# EAGLE design QSPIC Master (EAGLE 5.06)

## Sheet 1 of 2
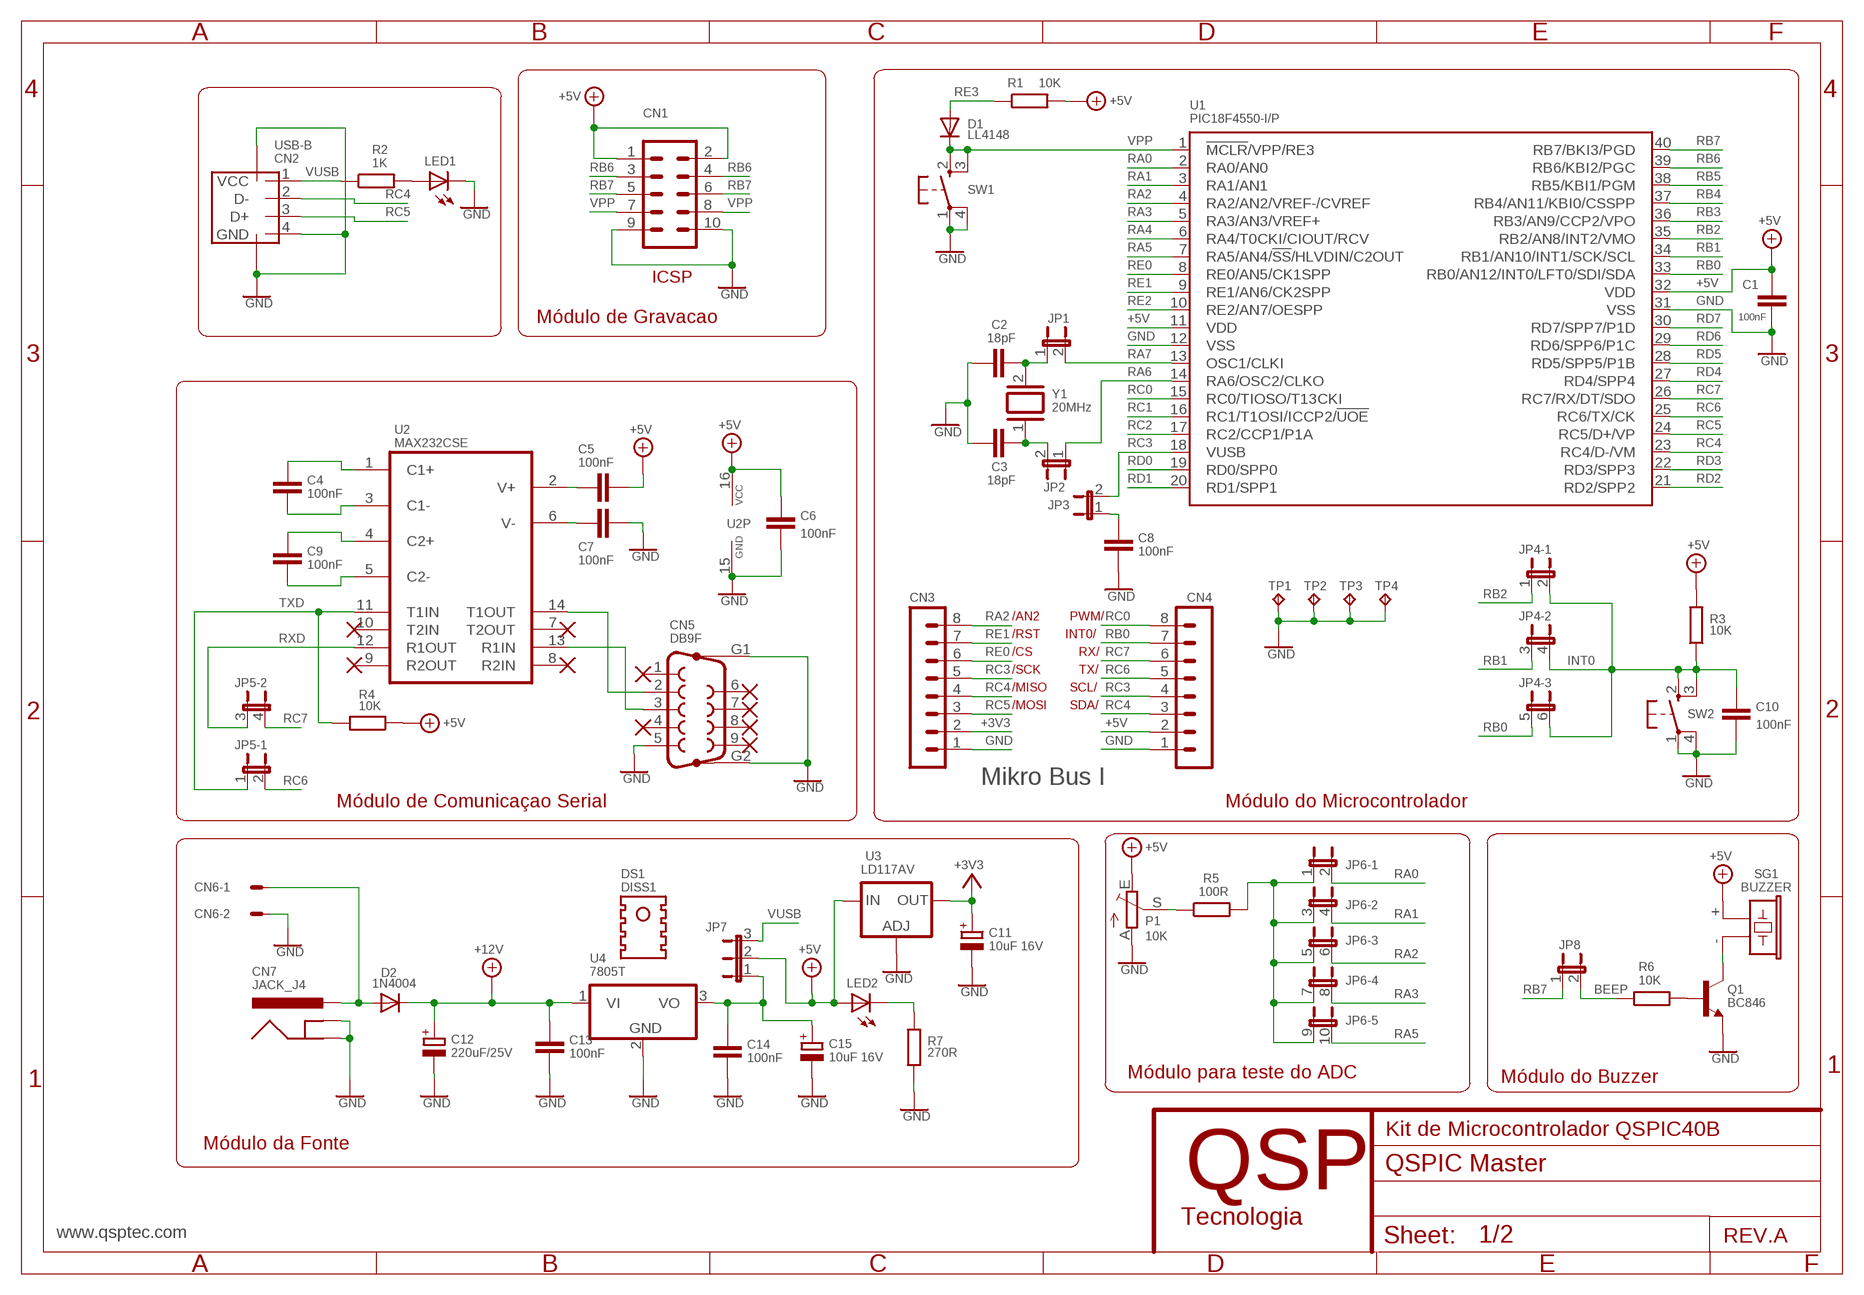
[diagram p0: schematic, sheet 1]

### Parts
C1  100nF  C-EUC0805K  [C0805K]
C2  18pF  C-EUC0805K  [C0805K]
C3  18pF  C-EUC0805K  [C0805K]
C4  100nF  C-EUC0805K  [C0805K]
C5  100nF  C-EUC0805K  [C0805K]
C6  100nF  C-EUC0805K  [C0805K]
C7  100nF  C-EUC0805K  [C0805K]
C8  100nF  C-EUC0805K  [C0805K]
C9  100nF  C-EUC0805K  [C0805K]
C10  100nF  C-EUC0805K  [C0805K]
C11  10uF 16V  CPOL-EUE2.5-6  [E2,5-6]
C12  220uF/25V  CPOL-EUE5-8.5  [E5-8,5]
C13  100nF  C-EUC0805K  [C0805K]
C14  100nF  C-EUC0805K  [C0805K]
C15  10uF 16V  CPOL-EUE2.5-6  [E2,5-6]
CN1  ML10  [ML10]
CN2  USB-B  [327560-2]
CN3  MA08-1  [MA08-1]
CN4  MA08-1  [MA08-1]
CN5  DB9F  F09HP  [F09HP]
CN6  KF158V-2P  [KF158V]
CN7  JACK_J4  [JACK_J4]
D1  LL4148  DIODE-MINIMELF  [MINIMELF]
D2  1N4004  [DO41-10]
DS1  DISS1  [DISS1]
JP1  JP1E  [JP1]
JP2  JP1E  [JP1]
JP3  JP1E  [JP1]
JP4  JP3QE  [JP3Q]
JP5  JP2QE  [JP2Q]
JP6  JP5QE  [JP5Q]
JP7  JP2E  [JP2]
JP8  JP1E  [JP1]
LED1  LEDCHIPLED_0805  [CHIPLED_0805]
LED2  LED3MM  [LED3MM]
P1  10K  TRIM_EU-RS3  [RS3]
Q1  BC846  BC846ASMD  [SOT23]
R1  10K  R-EU_R0805  [R0805]
R2  1K  R-EU_M0805  [M0805]
R3  10K  R-EU_R0805  [R0805]
R4  10K  R-EU_R0805  [R0805]
R5  100R  R-EU_R0805  [R0805]
R6  10K  R-EU_R0805  [R0805]
R7  270R  R-EU_R0805  [R0805]
SG1  BUZZER  [BUZZER]
SW1  CHAVETACTILSMD  [TACTILSMD]
SW2  CHAVETACTILSMD  [TACTILSMD]
TP1  TPPAD1-17  [P1-17]
TP2  TPPAD1-17  [P1-17]
TP3  TPPAD1-17  [P1-17]
TP4  TPPAD1-17  [P1-17]
U1  PIC18F4550-I/P  PIC18F4550_40  [DIL40]
U2  MAX232CSE  [SO16]
U3  LD117AV  [TO220L1]
U4  7805T  [TO220H]
Y1  20MHz  XTAL/S  [QS]

### Nets
+3V3: C11.+ CN3.2 U3.2(OUT)
+5V: C1.1 C5.2 C6.1 CN1.1 CN1.2 CN4.2 JP7.2 LED2.A P1.E R1.2 R3.2 R4.1 SG1.+ U1.11(VDD) U1.32(VDD) U2.16(VCC) U3.3(IN) ; also sheet 2
+12V: C12.+ C13.1 D2.C U4.1(VI) ; also sheet 2
BEEP: JP8.2 R6.1
GND: C1.2 C2.1 C3.1 C6.2 C7.2 C8.2 C10.2 C11.- C12.- C13.2 C14.2 C15.- CN1.9 CN1.10 CN2.4(GND) CN2.P$5 CN2.P$6 CN3.1 CN4.1 CN5.5 CN5.G1 CN5.G2 CN6.2 CN7.GND CN7.GNDBREAK LED1.C P1.A Q1.2(E) R7.1 SW1.1(P) SW1.4(P1) SW2.1(P) SW2.4(P1) TP1.1(TP) TP2.1(TP) TP3.1(TP) TP4.1(TP) U1.12(VSS) U1.31(VSS) U2.15(GND) U3.1(ADJ) U4.2(GND) ; also sheet 2
INT0: C10.1 JP4.2 JP4.4 JP4.6 R3.1 SW2.2(S) SW2.3(S1)
N$7: C8.1 JP3.1
N$10: CN6.1 CN7.PWR D2.A
N$12: P1.S R5.1
N$15: LED2.K(C) R7.2
N$16: LED1.A R2.2
N$17: C4.1 U2.1(C1+)
N$18: C4.2 U2.3(C1-)
N$19: C9.1 U2.4(C2+)
N$23: JP6.1 JP6.3 JP6.5 JP6.7 JP6.9 R5.2
N$25: C14.1 C15.+ JP7.1 U4.3(VO)
N$34: C9.2 U2.5(C2-)
N$35: CN5.2 U2.14(T1OUT)
N$36: CN5.3 U2.13(R1IN)
N$37: C5.1 U2.2(V+)
N$38: C7.1 U2.6(V-)
N$48: Q1.3(C) SG1.-
N$49: Q1.1(B) R6.2
RA0: JP6.2 U1.2(RA0/AN0) ; also sheet 2
RA1: JP6.4 U1.3(RA1/AN1) ; also sheet 2
RA2: CN3.8 JP6.6 U1.4(RA2/AN2/VREF-/CVREF) ; also sheet 2
RA3: JP6.8 U1.5(RA3/AN3/VREF+) ; also sheet 2
RA4: U1.6(RA4/T0CKI/CIOUT/RCV) ; also sheet 2
RA5: JP6.10 U1.7(RA5/AN4/!SS!/HLVDIN/C2OUT) ; also sheet 2
RA6: JP2.1 U1.14(RA6/OSC2/CLKO) ; also sheet 2
RA7: JP1.2 U1.13(OSC1/CLKI) ; also sheet 2
RB0: CN4.7 JP4.5 U1.33(RB0/AN12/INT0/LFT0/SDI/SDA) ; also sheet 2
RB1: JP4.3 U1.34(RB1/AN10/INT1/SCK/SCL) ; also sheet 2
RB2: JP4.1 U1.35(RB2/AN8/INT2/VMO) ; also sheet 2
RB3: U1.36(RB3/AN9/CCP2/VPO) ; also sheet 2
RB4: U1.37(RB4/AN11/KBI0/CSSPP) ; also sheet 2
RB5: U1.38(RB5/KBI1/PGM) ; also sheet 2
RB6: CN1.3 CN1.4 U1.39(RB6/KBI2/PGC) ; also sheet 2
RB7: CN1.5 CN1.6 JP8.1 U1.40(RB7/BKI3/PGD) ; also sheet 2
RC0: CN4.8 U1.15(RC0/TIOSO/T13CKI) ; also sheet 2
RC1: U1.16(RC1/T1OSI/ICCP2/!UOE) ; also sheet 2
RC2: U1.17(RC2/CCP1/P1A) ; also sheet 2
RC3: CN3.5 CN4.4 JP3.2 U1.18(VUSB) ; also sheet 2
RC4: CN2.2(D-) CN3.4 CN4.3 U1.23(RC4/D-/VM) ; also sheet 2
RC5: CN2.3(D+) CN3.3 U1.24(RC5/D+/VP) ; also sheet 2
RC6: CN4.5 JP5.2 U1.25(RC6/TX/CK) ; also sheet 2
RC7: CN4.6 JP5.4 U1.26(RC7/RX/DT/SDO) ; also sheet 2
RD0: U1.19(RD0/SPP0) ; also sheet 2
RD1: U1.20(RD1/SPP1) ; also sheet 2
RD2: U1.21(RD2/SPP2) ; also sheet 2
RD3: U1.22(RD3/SPP3) ; also sheet 2
RD4: U1.27(RD4/SPP4) ; also sheet 2
RD5: U1.28(RD5/SPP5/P1B) ; also sheet 2
RD6: U1.29(RD6/SPP6/P1C) ; also sheet 2
RD7: U1.30(RD7/SPP7/P1D) ; also sheet 2
RE0: CN3.6 U1.8(RE0/AN5/CK1SPP) ; also sheet 2
RE1: CN3.7 U1.9(RE1/AN6/CK2SPP) ; also sheet 2
RE2: U1.10(RE2/AN7/OESPP) ; also sheet 2
RE3: D1.A R1.1 ; also sheet 2
RXD: JP5.3 U2.12(R1OUT)
TXD: JP5.1 R4.2 U2.11(T1IN)
VPP: CN1.7 CN1.8 D1.C SW1.2(S) SW1.3(S1) U1.1(!MCLR!/VPP/RE3)
VUSB: CN2.1(VCC) JP7.3 R2.1
Y1OSC3: C2.2 JP1.1 Y1.2
Y1OSC4: C3.2 JP2.2 Y1.1
Unconnected: CN5.1 CN5.4 CN5.6 CN5.7 CN5.8 CN5.9 U2.7(T2OUT) U2.8(R2IN) U2.9(R2OUT) U2.10(T2IN)

### Notes on the sheet
- ICSP
- Módulo de Gravacao
- /AN2 | PWM/
- /RST | INT0/
- /CS | RX/
- /SCK | TX/
- /MISO | SCL/
- /MOSI | SDA/
- Mikro Bus I
- Módulo de Comunicaçao Serial | Módulo do Microcontrolador
- Módulo para teste do ADC | Módulo do Buzzer
- Kit de Microcontrolador QSPIC40B
- Módulo da Fonte
- QSP
- Tecnologia
- www.qsptec.com | REV.A

## Sheet 2 of 2
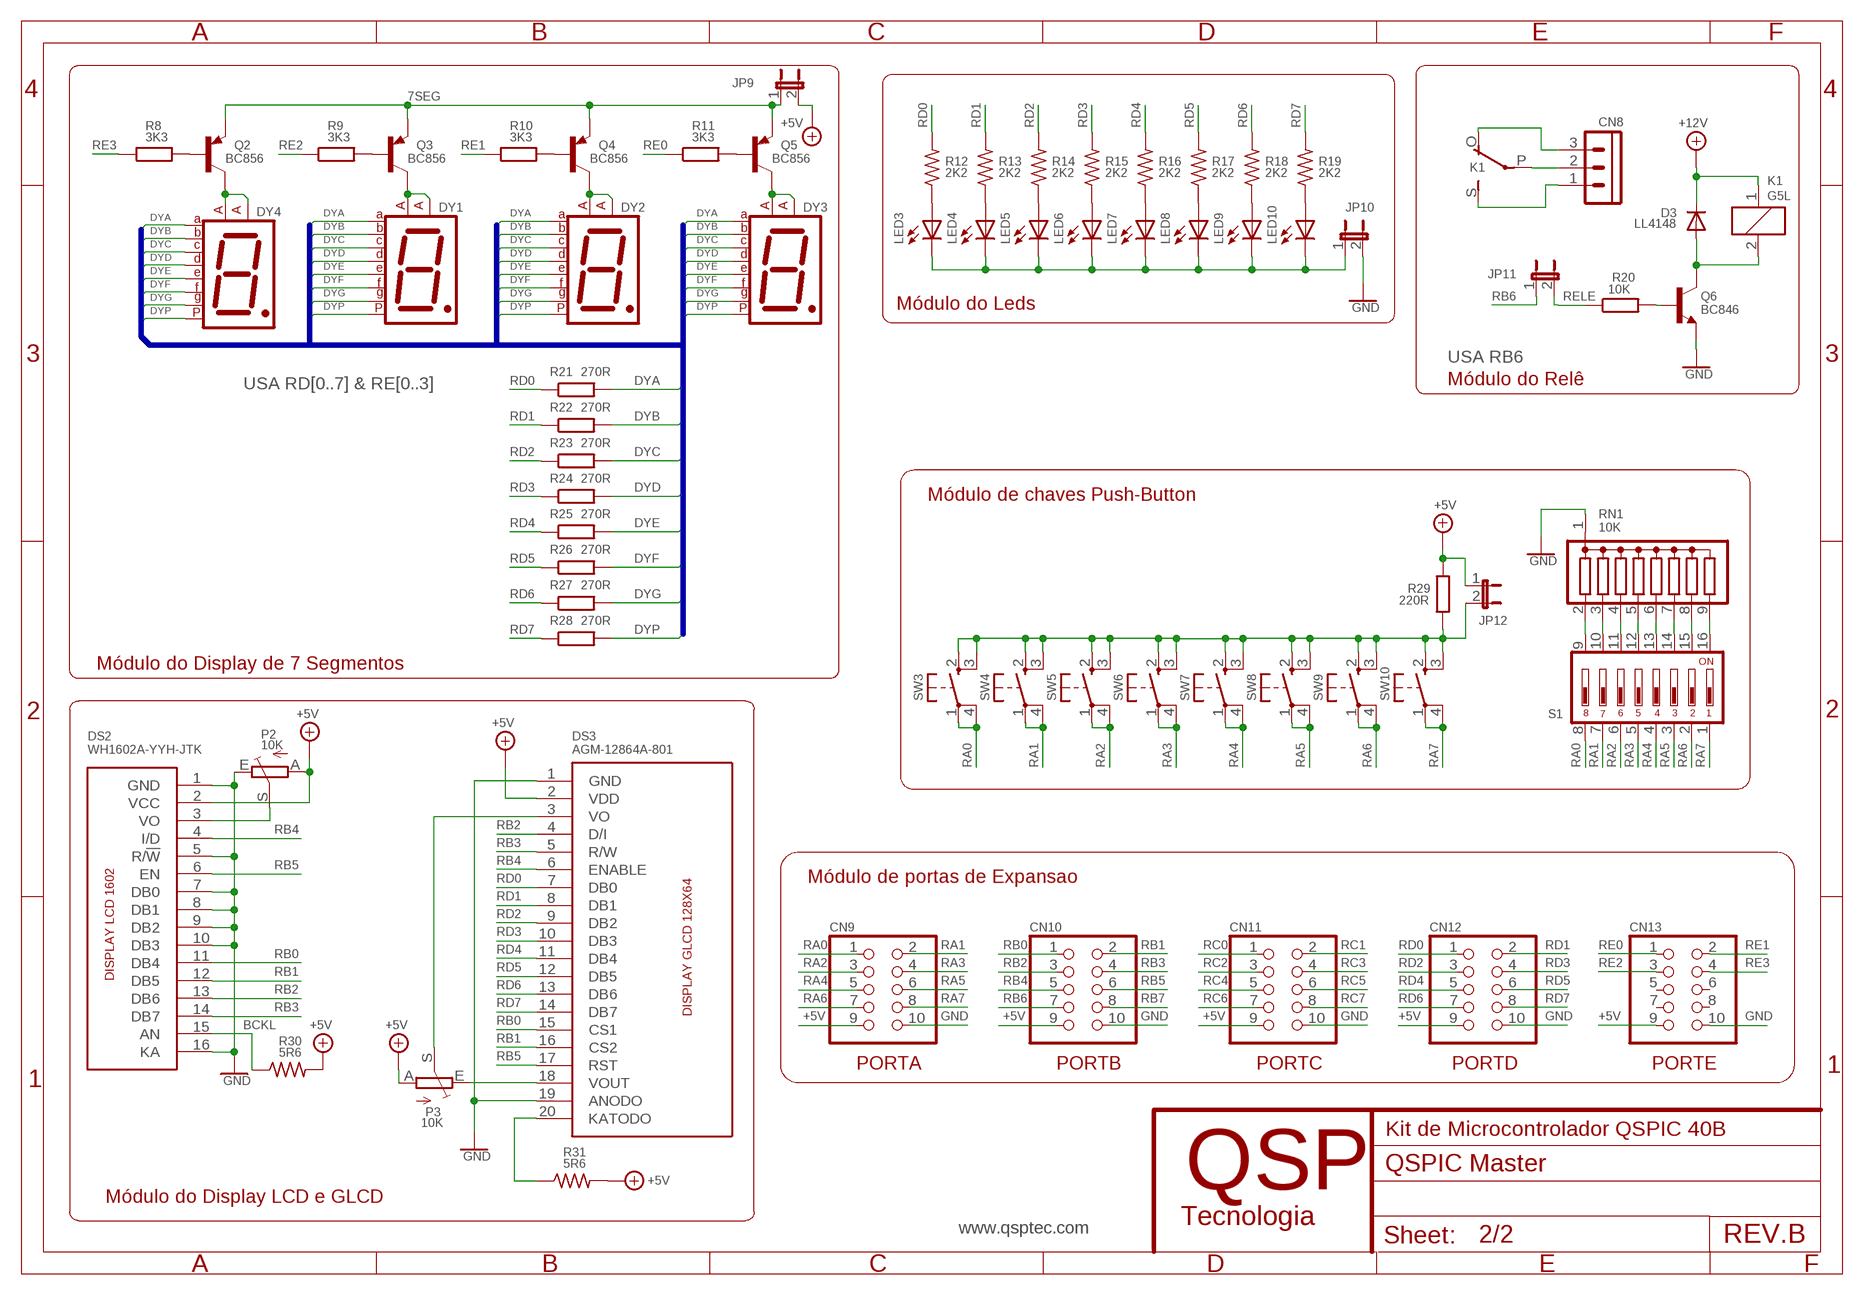
[diagram p1: schematic, sheet 2]

### Parts
CN8  KF-301  [KF-301]
CN9  PINHD-2X5  [2X05]
CN10  PINHD-2X5  [2X05]
CN11  PINHD-2X5  [2X05]
CN12  PINHD-2X5  [2X05]
CN13  PINHD-2X5  [2X05]
D3  LL4148  DIODE-MINIMELF  [MINIMELF]
DS2  WH1602A-YYH-JTK  [WH1602A]
DS3  AGM-12864A-801  W12864  [W12864]
DY1  A551-E  7SEG-CA  [7SEG-13]
DY2  A551-E  7SEG-CA  [7SEG-13]
DY3  A551-E  7SEG-CA  [7SEG-13]
DY4  A551-E  7SEG-CA  [7SEG-13]
JP9  JP1E  [JP1]
JP10  JP1E  [JP1]
JP11  JP1E  [JP1]
JP12  JP1E  [JP1]
K1  G5L  [G5LE]
LED3  LED3MM  [LED3MM]
LED4  LED3MM  [LED3MM]
LED5  LED3MM  [LED3MM]
LED6  LED3MM  [LED3MM]
LED7  LED3MM  [LED3MM]
LED8  LED3MM  [LED3MM]
LED9  LED3MM  [LED3MM]
LED10  LED3MM  [LED3MM]
P2  10K  TRIM_EU-RS3  [RS3]
P3  10K  TRIM_EU-RS3  [RS3]
Q2  BC856  BC856BSMD  [SOT23-BEC]
Q3  BC856  BC856BSMD  [SOT23-BEC]
Q4  BC856  BC856BSMD  [SOT23-BEC]
Q5  BC856  BC856BSMD  [SOT23-BEC]
Q6  BC846  BC846ASMD  [SOT23]
R8  3K3  R-EU_R0805  [R0805]
R9  3K3  R-EU_R0805  [R0805]
R10  3K3  R-EU_R0805  [R0805]
R11  3K3  R-EU_R0805  [R0805]
R12  2K2  R-US_R0805  [R0805]
R13  2K2  R-US_R0805  [R0805]
R14  2K2  R-US_R0805  [R0805]
R15  2K2  R-US_R0805  [R0805]
R16  2K2  R-US_R0805  [R0805]
R17  2K2  R-US_R0805  [R0805]
R18  2K2  R-US_R0805  [R0805]
R19  2K2  R-US_R0805  [R0805]
R20  10K  R-EU_R0805  [R0805]
R21  270R  R-EU_R0805  [R0805]
R22  270R  R-EU_R0805  [R0805]
R23  270R  R-EU_R0805  [R0805]
R24  270R  R-EU_M0805  [M0805]
R25  270R  R-EU_M0805  [M0805]
R26  270R  R-EU_M0805  [M0805]
R27  270R  R-EU_M0805  [M0805]
R28  270R  R-EU_M0805  [M0805]
R29  220R  R-EU_M0805  [M0805]
R30  5R6  R-US_M1206  [M1206]
R31  5R6  R-US_M1206  [M1206]
RN1  10K  G08R  [SIL9]
S1  DS08  [DS-08]
SW3  CHAVETACTILSMD  [TACTILSMD]
SW4  CHAVETACTILSMD  [TACTILSMD]
SW5  CHAVETACTILSMD  [TACTILSMD]
SW6  CHAVETACTILSMD  [TACTILSMD]
SW7  CHAVETACTILSMD  [TACTILSMD]
SW8  CHAVETACTILSMD  [TACTILSMD]
SW9  CHAVETACTILSMD  [TACTILSMD]
SW10  CHAVETACTILSMD  [TACTILSMD]

### Nets
7SEG: JP9.1 Q2.E Q3.E Q4.E Q5.E
+5V: CN9.9 CN10.9 CN11.9 CN12.9 CN13.9 DS2.2(VCC) DS3.2(VDD) JP9.2 JP12.1 P2.A P3.A R29.2 R30.2 R31.2 ; also sheet 1
+12V: D3.C K1.1 ; also sheet 1
BCKL: DS2.15(AN) R30.1
DYA: DY1.7(A) DY2.7(A) DY3.7(A) DY4.7(A) R21.2
DYB: DY1.6(B) DY2.6(B) DY3.6(B) DY4.6(B) R22.2
DYC: DY1.4(C) DY2.4(C) DY3.4(C) DY4.4(C) R23.2
DYD: DY1.2(D) DY2.2(D) DY3.2(D) DY4.2(D) R24.2
DYE: DY1.1(E) DY2.1(E) DY3.1(E) DY4.1(E) R25.2
DYF: DY1.9(F) DY2.9(F) DY3.9(F) DY4.9(F) R26.2
DYG: DY1.10(G) DY2.10(G) DY3.10(G) DY4.10(G) R27.2
DYP: DY1.5(DP) DY2.5(DP) DY3.5(DP) DY4.5(DP) R28.2
GND: CN9.10 CN10.10 CN11.10 CN12.10 CN13.10 DS2.1(GND) DS2.5(R/!W) DS2.7(DB0) DS2.8(DB1) DS2.9(DB2) DS2.10(DB3) DS2.16(KA) DS3.1(GND) DS3.19(ANODO) JP10.2 P2.E Q6.2(E) RN1.1 ; also sheet 1
N$1: DS3.20(KATODO) R31.1
N$2: Q4.B R10.2
N$3: DY3.3(CA1) DY3.8(CA2) Q5.C
N$4: CN8.2 K1.P(2:P)
N$5: CN8.3 K1.O(2:O)
N$6: CN8.1 K1.S(2:S)
N$8: DY2.3(CA1) DY2.8(CA2) Q4.C
N$9: DY4.3(CA1) DY4.8(CA2) Q2.C
N$11: Q3.B R9.2
N$13: Q2.B R8.2
N$20: Q5.B R11.2
N$21: DS3.18(VOUT) P3.E
N$22: DS3.3(VO) P3.S
N$24: DS2.3(VO) P2.S
N$26: LED10.A R19.1
N$27: LED9.A R18.1
N$28: LED8.A R17.1
N$29: LED7.A R16.1
N$30: LED6.A R15.1
N$31: LED5.A R14.1
N$32: LED4.A R13.1
N$33: LED3.A R12.1
N$39: JP12.2 R29.1 SW3.2(S) SW3.3(S1) SW4.2(S) SW4.3(S1) SW5.2(S) SW5.3(S1) SW6.2(S) SW6.3(S1) SW7.2(S) SW7.3(S1) SW8.2(S) SW8.3(S1) SW9.2(S) SW9.3(S1) SW10.2(S) SW10.3(S1)
N$40: RN1.2 S1.9
N$41: RN1.3 S1.10
N$42: RN1.4 S1.11
N$43: RN1.5 S1.12
N$44: RN1.6 S1.13
N$45: RN1.7 S1.14
N$46: RN1.8 S1.15
N$47: RN1.9 S1.16
N$56: DY1.3(CA1) DY1.8(CA2) Q3.C
N$64: Q6.1(B) R20.2
N$66: D3.A K1.2 Q6.3(C)
PD_LED: JP10.1 LED3.K(C) LED4.K(C) LED5.K(C) LED6.K(C) LED7.K(C) LED8.K(C) LED9.K(C) LED10.K(C)
RA0: CN9.1 S1.8 SW3.1(P) SW3.4(P1) ; also sheet 1
RA1: CN9.2 S1.7 SW4.1(P) SW4.4(P1) ; also sheet 1
RA2: CN9.3 S1.6 SW5.1(P) SW5.4(P1) ; also sheet 1
RA3: CN9.4 S1.5 SW6.1(P) SW6.4(P1) ; also sheet 1
RA4: CN9.5 S1.4 SW7.1(P) SW7.4(P1) ; also sheet 1
RA5: CN9.6 S1.3 SW8.1(P) SW8.4(P1) ; also sheet 1
RA6: CN9.7 S1.2 SW9.1(P) SW9.4(P1) ; also sheet 1
RA7: CN9.8 S1.1 SW10.1(P) SW10.4(P1) ; also sheet 1
RB0: CN10.1 DS2.11(DB4) DS3.15(CS1) ; also sheet 1
RB1: CN10.2 DS2.12(DB5) DS3.16(CS2) ; also sheet 1
RB2: CN10.3 DS2.13(DB6) DS3.4(D/I) ; also sheet 1
RB3: CN10.4 DS2.14(DB7) DS3.5(R/W) ; also sheet 1
RB4: CN10.5 DS2.4(I/D) DS3.6(ENABLE) ; also sheet 1
RB5: CN10.6 DS2.6(EN) DS3.17(RST) ; also sheet 1
RB6: CN10.7 JP11.1 ; also sheet 1
RB7: CN10.8 ; also sheet 1
RC0: CN11.1 ; also sheet 1
RC1: CN11.2 ; also sheet 1
RC2: CN11.3 ; also sheet 1
RC3: CN11.4 ; also sheet 1
RC4: CN11.5 ; also sheet 1
RC5: CN11.6 ; also sheet 1
RC6: CN11.7 ; also sheet 1
RC7: CN11.8 ; also sheet 1
RD0: CN12.1 DS3.7(DB0) R12.2 R21.1 ; also sheet 1
RD1: CN12.2 DS3.8(DB1) R13.2 R22.1 ; also sheet 1
RD2: CN12.3 DS3.9(DB2) R14.2 R23.1 ; also sheet 1
RD3: CN12.4 DS3.10(DB3) R15.2 R24.1 ; also sheet 1
RD4: CN12.5 DS3.11(DB4) R16.2 R25.1 ; also sheet 1
RD5: CN12.6 DS3.12(DB5) R17.2 R26.1 ; also sheet 1
RD6: CN12.7 DS3.13(DB6) R18.2 R27.1 ; also sheet 1
RD7: CN12.8 DS3.14(DB7) R19.2 R28.1 ; also sheet 1
RE0: CN13.1 R11.1 ; also sheet 1
RE1: CN13.2 R10.1 ; also sheet 1
RE2: CN13.3 R9.1 ; also sheet 1
RE3: CN13.4 R8.1 ; also sheet 1
RELE: JP11.2 R20.1
Unconnected: CN13.5 CN13.6 CN13.7 CN13.8

### Buses
B$1

### Notes on the sheet
- Módulo do Leds
- USA RB6
- USA RD[0..7] & RE[0..3] | Módulo do Relê
- Módulo de chaves Push-Button
- Módulo do Display de 7 Segmentos
- Módulo de portas de Expansao
- DISPLAY GLCD 128X64
- PORTA | PORTB | PORTC | PORTD | PORTE
- Kit de Microcontrolador QSPIC 40B
- QSP
- Módulo do Display LCD e GLCD
- Tecnologia
- www.qsptec.com
- REV.B

## Library data of the parts
C1-C10 C13 C14 = rcl:C-EU: CAPACITOR, European symbol
C11 C12 C15 = rcl:CPOL-EU: POLARIZED CAPACITOR, European symbol
CN1 = con-harting-ml:ML10: HARTING
CN2 = -Connec:USB-B
CN3 CN4 = con-lstb:MA08-1: PIN HEADER
CN5 = con-subd:F09HP: SUB-D
CN6 = Conector:KF158V-2P
CN7 = Conector:JACK_J4
CN8 = Conector:KF-301
CN9-CN13 = pinhead:PINHD-2X5: PIN HEADER
D1 D3 = diode:DIODE-: DIODE
D2 = diode:1N4004: DIODE general purpose rectifier, 1 A
DS1 = Dissipador:DISS1
DS2 = lcd_2x16_led_backlight:WH1602A
DS3 = w12864:W12864
DY1-DY4 = special:7SEG-CA: 7-segment DISPLAY single anode, 13 mm
JP1-JP3 JP8-JP12 = jumper:JP1E: JUMPER
JP4 = jumper:JP3QE: JUMPER
JP5 = jumper:JP2QE: JUMPER
JP6 = jumper:JP5QE: JUMPER
JP7 = jumper:JP2E: JUMPER
K1 = relay:G5L: RELAY 1 x switch, 10 A/120 V AC, 8 A/30 V ADC, Omron
LED1-LED10 = led:LED: LED OSRAM: - CHIPLED LG R971, LG N971, LY N971, LG Q971, LY Q971, LO R971, LY R971 LH N974, LH R974 LS Q976, LO Q976, LY Q976 LO Q996 - Hyper CHIPLED LW Q18S LB Q993, LB Q99A, LB R99A - SideLED LS A670, LO A670, LY A670, LG A670, LP A670 LB A673, LV A673, LT A673, LW A673 LH A674 LY A675 LS A676, LA A676, LO A676, LY A676, LW A676 LS A679, LY A679, LG A679 - Hyper Micro SIDELED® LS Y876, LA Y876, LO Y876, LY Y876 LT Y87S - SmartLED LW L88C, LW L88S LB L89C, LB L89S, LG L890 LS L89K, LO L89K, LY L89K LS L896, LA L896, LO L896, LY L896 - TOPLED LS T670, LO T670, LY T670, LG T670, LP T670 LSG T670, LSP T670, LSY T670, LOP T670, LYG T670 LG T671, LOG T671, LSG T671 LB T673, LV T673, LT T673, LW T673 LH T674 LS T676, LA T676, LO T676, LY T676, LB T676, LH T676, LSB T676, LW T676 LB T67C, LV T67C, LT T67C, LS T67K, LO T67K, LY T67K, LW E67C LS E67B, LA E67B, LO E67B, LY E67B, LB E67C, LV E67C, LT E67C LW T67C LS T679, LY T679, LG T679 LS T770, LO T770, LY T770, LG T770, LP T770 LB T773, LV T773, LT T773, LW T773 LH T774 LS E675, LA E675, LY E675, LS T675 LS T776, LA T776, LO T776, LY T776, LB T776 LHGB T686 LT T68C, LB T68C - Hyper Mini TOPLED® LB M676 - Mini TOPLED Santana® LG M470 LS M47K, LO M47K, LY M47K Source: http://www.osram.convergy.de/
P1-P3 = pot:TRIM_EU-: POTENTIOMETER
Q1 Q6 = transistor-npn:BC846*: NPN Transistor
Q2-Q5 = transistor-pnp:BC856*: PNP Transistror
R1-R11 R20-R29 = rcl:R-EU_: RESISTOR, European symbol
R12-R19 R31 = resistor:R-US_: RESISTOR, American symbol
R30 = rcl:R-US_: RESISTOR, American symbol
RN1 = resistor-sil:G08R: SIL RESISTOR
S1 = switch-dil:DS08: DIL/CODE SWITCH
SG1 = Audio:BUZZER
SW1-SW10 = w12864:CHAVETACTILSMD
TP1-TP4 = testpad:TP: Test pad
U1 = microchip:PIC18F4*_40: USB Microcontrollers with nanoWatt Technology High-Performance, Enhanced Flash, 28/40/44-Pin, Source: http://ww1.microchip.com/downloads/en/devicedoc/39632c.pdf
U2 = maxim:MAX232: RS232 TRANSEIVER
U3 = v-reg:LD117A?*: Low drop fixed and adjustable positive voltage regulators 1 A Source: http://www.st.com/stonline/products/literature/ds/7194/ld1117axx.pdf
U4 = linear:78*: Positive VOLTAGE REGULATOR Source: http://cache.national.com/ds/LM/LM78L05.pdf http://www.fairchildsemi.com/ds/LM/LM7805.pdf
Y1 = special:XTAL/S: CRYSTAL

## Net classes
1 5V: width 0.508 mm

## Board
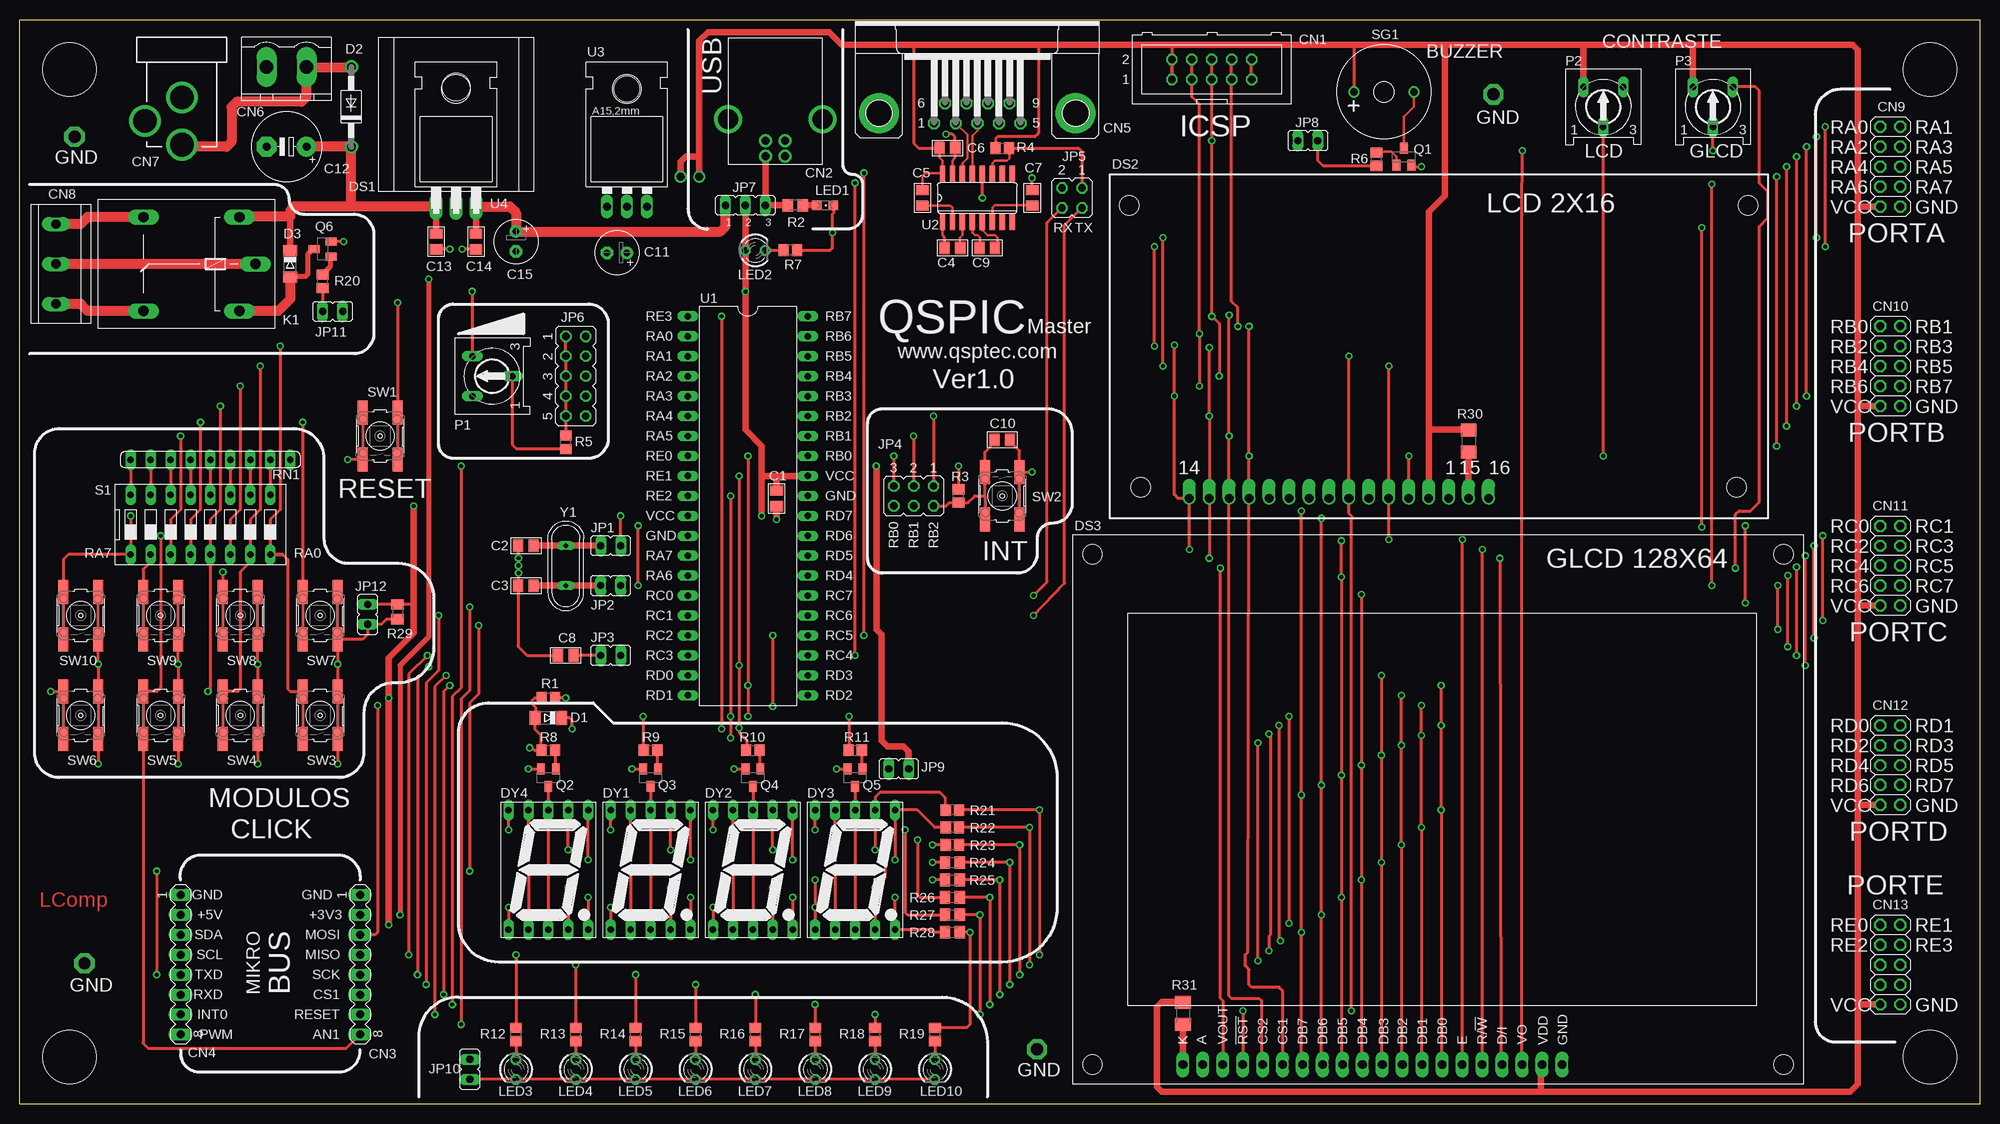
[diagram p2: board, top side]
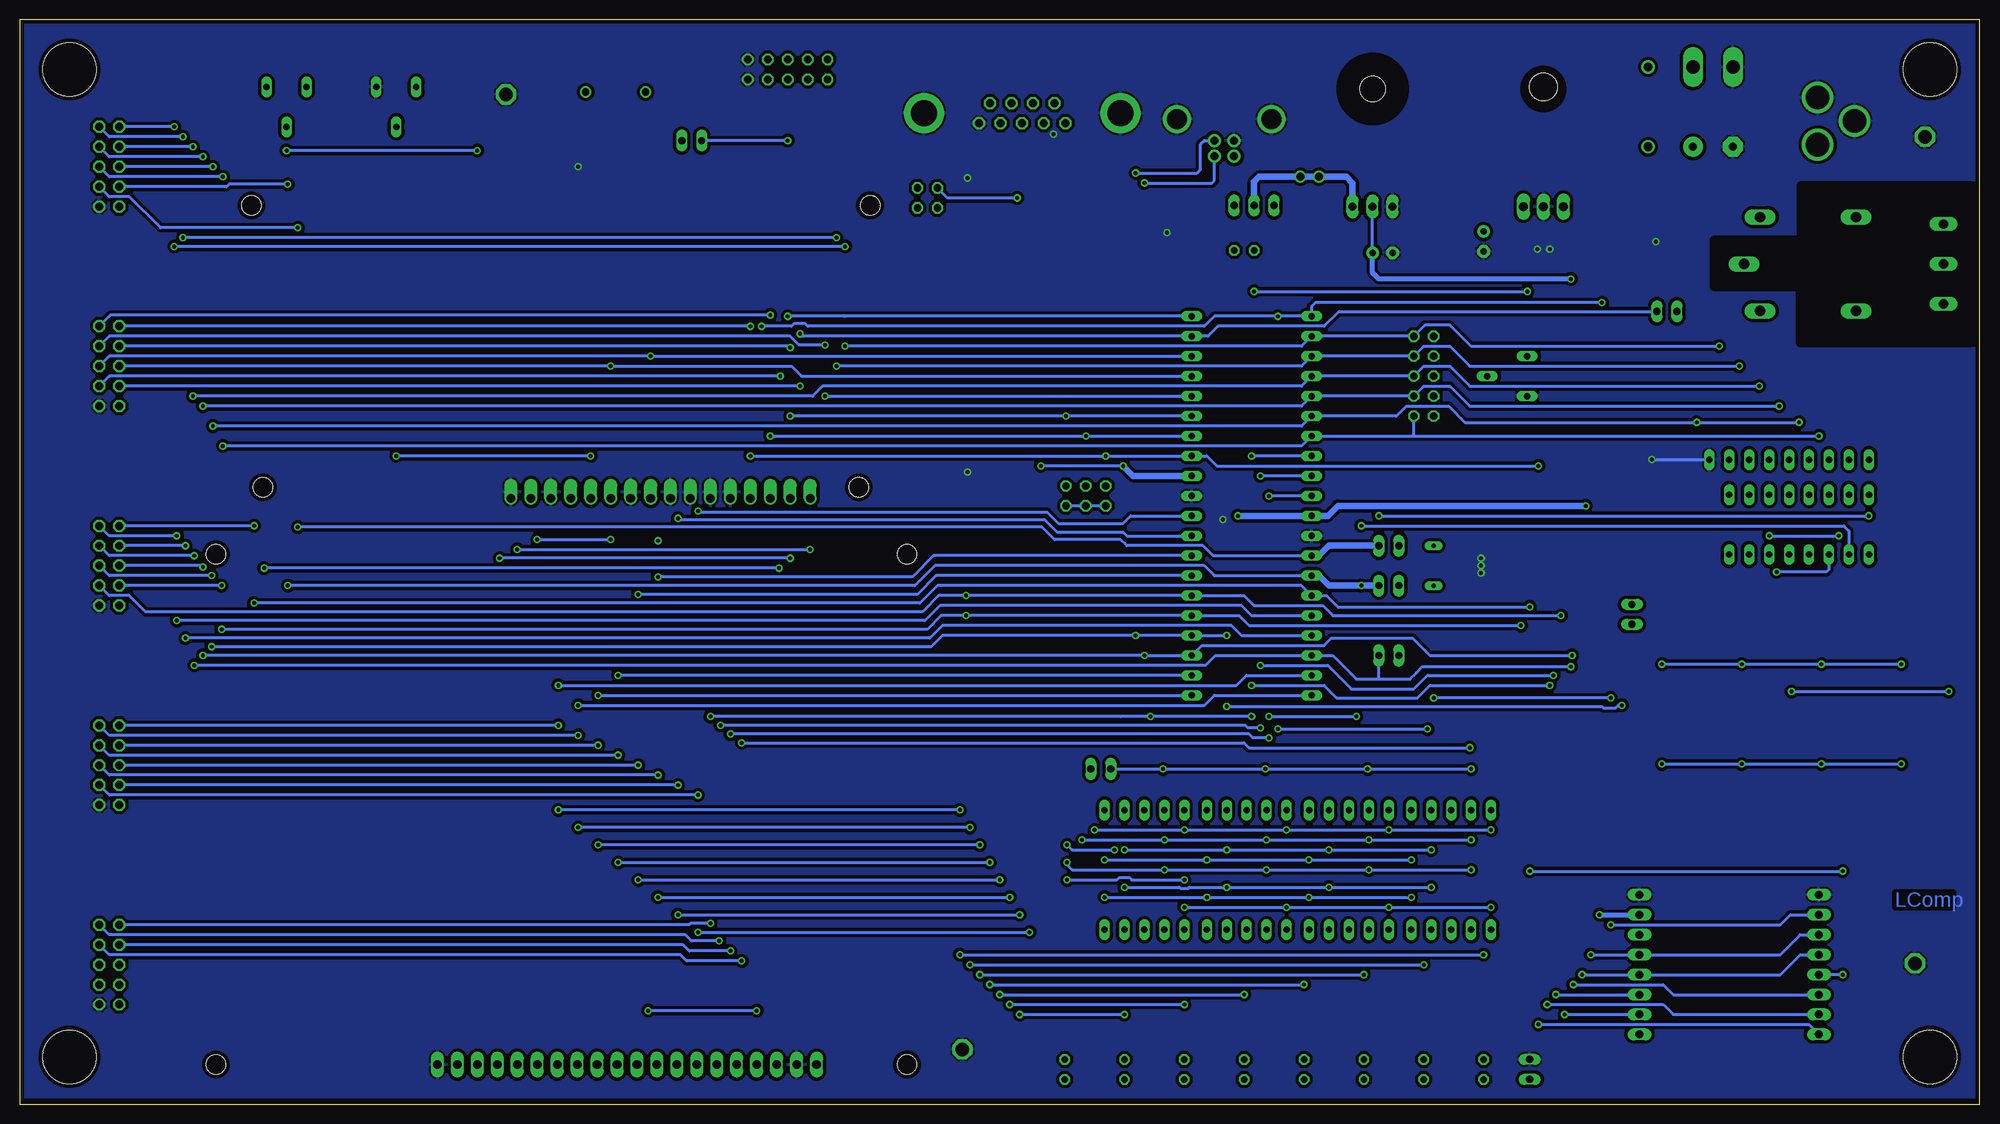
[diagram p3: board, bottom side, seen from below]

Size 249.56 x 138.11 mm. Coordinates in mm from the lower left corner, seen from the top.
Outline: 0,138.11 249.56,138.11 249.56,0 0,0 0,138.11
Copper layers (1*16): Top 0.035mm / dielectric 1.5mm / Bottom 0.035mm
Design rules "default *": minimum track width 12mil, minimum drill 0.5mm, track to track 12mil, track to pad 12mil, pad to pad 12mil, via to via 12mil, smd to smd 8mil, copper to edge 20mil, drill to drill 12mil, minimum pad ring 10mil, minimum via ring 8mil, stop-mask expansion 4mil, vias tented up to drill 0mil, thermal gap 10mil
Holes 6.86 mm at 6.35,131.76 6.35,6.03 243.2,131.76 243.2,6.03
bRestrict: area 1.1,97 to 33.8,117

### Footprints (pad centres in the part's own frame; a part is rotated, then mirrored left to right if it is on the bottom)
C0805K = smd 1.3 x 1.6: 1 -1,0; 2 1,0
E2,5-6 = drill 0.813 pad 1.6 round: + -1.27,0 | drill 0.813 pad 1.6 octagon: - 1.27,0
E5-8,5 = drill 1.016 pad 2.54 round: + -2.54,0 | drill 1.016 pad 2.54 octagon: - 2.54,0
ML10 = drill 0.914 octagon: 1 -5.08,-1.27; 2 -5.08,1.27; 3 -2.54,-1.27; 4 -2.54,1.27; 5 0,-1.27; 6 0,1.27; 7 2.54,-1.27; 8 2.54,1.27; 9 5.08,-1.27; 10 5.08,1.27
327560-2 = drill 1.016 pad 1.676 round: 1 1.25,2; 2 -1.25,2; 3 -1.25,0; 4 1.25,0 | drill 2.54 pad 3 round: P$5 -6,-2.7; P$6 6,-2.7
MA08-1 = drill 1.016 long: 1 -8.89,0; 2 -6.35,0; 3 -3.81,0; 4 -1.27,0; 5 1.27,0; 6 3.81,0; 7 6.35,0; 8 8.89,0
F09HP = drill 1.016 octagon: 1 -5.486,-1.27; 2 -2.743,-1.27; 3 0,-1.27; 4 2.743,-1.27; 5 5.486,-1.27; 6 -4.115,1.27; 7 -1.372,1.27; 8 1.372,1.27; 9 4.115,1.27 | drill 3.302 pad 5.08 round: G1 -12.522,0; G2 12.522,0
KF158V = drill 1.7 long: 1 -2.54,0; 2 2.54,0
JACK_J4 = drill 2.997 round: GND 0,7.7; GNDBREAK 4.7,10.7; PWR 0,13.7
KF-301 = drill 1.194 long: 1 -5.08,0; 2 0,0; 3 5.08,0
2X05 = drill 1.016 octagon: 1 -5.08,-1.27; 2 -5.08,1.27; 3 -2.54,-1.27; 4 -2.54,1.27; 5 0,-1.27; 6 0,1.27; 7 2.54,-1.27; 8 2.54,1.27; 9 5.08,-1.27; 10 5.08,1.27
MINIMELF = smd 1.4 x 1.8: A 1.7,0; C -1.7,0
DO41-10 = drill 1.118 round: A 5.08,0; C -5.08,0
DISS1 = hole 3.556: 0,0
WH1602A = drill 1.1 offset: 1 43.18,-41.275; 2 40.64,-41.275; 3 38.1,-41.275; 4 35.56,-41.275; 5 33.02,-41.275; 6 30.48,-41.275; 7 27.94,-41.275; 8 25.4,-41.275; 9 22.86,-41.275; 10 20.32,-41.275; 11 17.78,-41.275; 12 15.24,-41.275; 13 12.7,-41.275; 14 10.16,-41.275; 15 45.72,-41.275; 16 48.26,-41.275 | hole 2.5: 3.969,-39.846; 2.54,-3.969; 81.28,-3.969; 79.851,-39.846
W12864 = drill 1.1 long: 1 15.06,-32.73; 2 12.52,-32.73; 3 9.98,-32.73; 4 7.44,-32.73; 5 4.9,-32.73; 6 2.36,-32.73; 7 -0.18,-32.73; 8 -2.72,-32.73; 9 -5.26,-32.73; 10 -7.8,-32.73; 11 -10.34,-32.73; 12 -12.88,-32.73; 13 -15.42,-32.73; 14 -17.96,-32.73; 15 -20.5,-32.73; 16 -23.04,-32.73; 17 -25.58,-32.73; 18 -28.12,-32.73; 19 -30.66,-32.73; 20 -33.2,-32.73 | hole 2.5: -44.71,32.26; -44.71,-32.74; 43.29,32.26; 43.29,-32.74
7SEG-13 = drill 0.813 long: 1 -5.08,-7.62; 2 -2.54,-7.62; 3 0,-7.62; 4 2.54,-7.62; 5 5.08,-7.62; 6 5.08,7.62; 7 2.54,7.62; 8 0,7.62; 9 -2.54,7.62; 10 -5.08,7.62
JP1 = drill 0.914 long: 1 0,-1.27; 2 0,1.27
JP3Q = drill 0.914 octagon: 1 -2.54,-1.27; 2 -2.54,1.27; 3 0,-1.27; 4 0,1.27; 5 2.54,-1.27; 6 2.54,1.27
JP2Q = drill 0.914 octagon: 1 -1.27,-1.27; 2 -1.27,1.27; 3 1.27,-1.27; 4 1.27,1.27
JP5Q = drill 0.914 octagon: 1 -5.08,-1.27; 2 -5.08,1.27; 3 -2.54,-1.27; 4 -2.54,1.27; 5 0,-1.27; 6 0,1.27; 7 2.54,-1.27; 8 2.54,1.27; 9 5.08,-1.27; 10 5.08,1.27
JP2 = drill 0.914 long: 1 -2.54,0; 2 0,0; 3 2.54,0
G5LE = drill 1.321 long: 1 -7.493,-5.969; 2 -7.493,5.969; O 4.699,5.969; P -9.525,0; S 4.699,-5.969
CHIPLED_0805 = smd 1.2 x 1.2: A 0,-1.05; C 0,1.05
LED3MM = drill 0.813 octagon: A -1.27,0; K 1.27,0
RS3 = drill 0.813 long: A -2.54,2.54; E 2.54,2.54; S 0,-2.54
SOT23 = smd 1 x 1.4: 1 -0.95,-1.1; 2 0.95,-1.1; 3 0,1.1
SOT23-BEC = smd 1 x 1.4: B -0.95,-1.1; C 0,1.1; E 0.95,-1.1
R0805 = smd 1.3 x 1.5: 1 -0.85,0; 2 0.85,0
M0805 = smd 1.3 x 1.6: 1 -0.95,0; 2 0.95,0
M1206 = smd 1.6 x 2: 1 -1.4,0; 2 1.4,0
SIL9 = drill 0.813 long: 1 -10.16,0; 2 -7.62,0; 3 -5.08,0; 4 -2.54,0; 5 0,0; 6 2.54,0; 7 5.08,0; 8 7.62,0; 9 10.16,0
DS-08 = drill 0.813 long: 1 -8.89,-3.81; 2 -6.35,-3.81; 3 -3.81,-3.81; 4 -1.27,-3.81; 5 1.27,-3.81; 6 3.81,-3.81; 7 6.35,-3.81; 8 8.89,-3.81; 9 8.89,3.81; 10 6.35,3.81; 11 3.81,3.81; 12 1.27,3.81; 13 -1.27,3.81; 14 -3.81,3.81; 15 -6.35,3.81; 16 -8.89,3.81
BUZZER = drill 0.9 round: + 3.81,0; - -3.81,0
TACTILSMD = smd 3.048 x 1.27: 1 -8.255,2.54; 2 -8.255,-1.905; 3 -2.223,-1.905; 4 -2.223,2.54
P1-17 = drill 1.702 pad 2.54 octagon: 1 0,0
DIL40 = drill 0.813 long: 1 -24.13,-7.62; 2 -21.59,-7.62; 3 -19.05,-7.62; 4 -16.51,-7.62; 5 -13.97,-7.62; 6 -11.43,-7.62; 7 -8.89,-7.62; 8 -6.35,-7.62; 9 -3.81,-7.62; 10 -1.27,-7.62; 11 1.27,-7.62; 12 3.81,-7.62; 13 6.35,-7.62; 14 8.89,-7.62; 15 11.43,-7.62; 16 13.97,-7.62; 17 16.51,-7.62; 18 19.05,-7.62; 19 21.59,-7.62; 20 24.13,-7.62; 21 24.13,7.62; 22 21.59,7.62; 23 19.05,7.62; 24 16.51,7.62; 25 13.97,7.62; 26 11.43,7.62; 27 8.89,7.62; 28 6.35,7.62; 29 3.81,7.62; 30 1.27,7.62; 31 -1.27,7.62; 32 -3.81,7.62; 33 -6.35,7.62; 34 -8.89,7.62; 35 -11.43,7.62; 36 -13.97,7.62; 37 -16.51,7.62; 38 -19.05,7.62; 39 -21.59,7.62; 40 -24.13,7.62
SO16 = smd 0.66 x 2.032: 1 -4.445,-3.073; 2 -3.175,-3.073; 3 -1.905,-3.073; 4 -0.635,-3.073; 5 0.635,-3.073; 6 1.905,-3.073; 7 3.175,-3.073; 8 4.445,-3.073; 9 4.445,3.073; 10 3.175,3.073; 11 1.905,3.073; 12 0.635,3.073; 13 -0.635,3.073; 14 -1.905,3.073; 15 -3.175,3.073; 16 -4.445,3.073
TO220L1 = drill 1.016 long: 1 -2.54,-3.81; 2 0,-3.81; 3 2.54,-3.81 | hole 3.302: 0,11.176
TO220H = drill 1.118 long: 1 -2.54,-10.16; 2 0,-10.16; 3 2.54,-10.16
QS = drill 0.61 long: 1 -2.54,0; 2 2.54,0

### Placement (x,y rotation side)
C1  96.36,77.15 270 top
C2  64.45,71.12 0 top
C3  64.45,66.04 0 top
C4  118.75,109.06 0 top
C5  114.94,115.41 90 top
C6  118.11,121.76 0 top
C7  128.91,115.41 90 top
C8  69.53,57.15 180 top
C9  123.19,109.06 0 top
C10  125.09,84.61 0 top
C11  76.04,108.43 180 top
C12  33.97,121.92 180 top
C13  53.02,109.86 270 top
C14  58.1,109.86 270 top
C15  63.18,109.86 270 top
CN1  151.76,131.76 0 top
CN2  96.2,122.71 180 top
CN3  43.34,17.78 270 top
CN4  20.48,17.78 270 top
CN5  121.92,126.21 0 top
CN6  33.97,132.08 180 top
CN7  20.64,135.89 180 top
CN8  4.6,107 270 top
CN9  238.12,119.38 270 top
CN10  238.12,93.98 270 top
CN11  238.12,68.58 270 top
CN12  238.12,43.18 270 top
CN13  238.12,17.78 270 top
D1  67.31,49.21 180 top
D2  42.23,127 90 top
D3  34.45,107 270 top
DS1  55.56,129.54 0 top
DS2  138.75,118.43 0 top
DS3  181.29,37.78 0 top
DY1  80.33,29.84 0 top
DY2  93.34,29.84 0 top
DY3  106.36,29.84 0 top
DY4  67.31,29.84 0 top
JP1  75.25,71.12 270 top
JP2  75.25,66.04 90 top
JP3  75.25,57.15 270 top
JP4  113.82,77.47 180 top
JP5  133.99,115.41 180 top
JP6  70.8,92.71 270 top
JP7  92.39,114.46 0 top
JP8  163.99,122.71 270 top
JP9  111.92,42.7 270 top
JP10  57.31,4.45 0 top
JP11  39.85,100.97 90 top
JP12  44.29,62.39 180 top
K1  20.48,107 180 top
LED1  102.55,114.46 270 top
LED2  93.66,108.74 0 top
LED3  63.18,4.45 270 top
LED4  70.8,4.45 270 top
LED5  78.42,4.45 270 top
LED6  86.04,4.45 270 top
LED7  93.66,4.45 270 top
LED8  101.28,4.45 270 top
LED9  108.9,4.45 270 top
LED10  116.52,4.45 270 top
P1  60.17,92.71 90 top
P2  201.61,127 0 top
P3  215.58,127 0 top
Q1  176.21,120.65 0 top
Q2  67.31,41.59 180 top
Q3  80.33,41.59 180 top
Q4  93.34,41.59 180 top
Q5  106.36,41.59 180 top
Q6  38.58,108.9 90 top
R1  67.31,51.75 0 top
R2  98.74,114.46 0 top
R3  119.54,77.47 90 top
R4  125.1,121.76 0 top
R5  69.53,84.3 90 top
R6  172.72,120.33 90 top
R7  98.11,108.74 180 top
R8  67.31,45.09 0 top
R9  80.33,45.09 0 top
R10  93.34,45.09 0 top
R11  106.36,45.09 0 top
R12  63.18,8.89 90 top
R13  70.8,8.89 90 top
R14  78.42,8.89 90 top
R15  86.04,8.89 90 top
R16  93.66,8.89 90 top
R17  101.28,8.89 90 top
R18  108.9,8.89 90 top
R19  116.52,8.89 90 top
R20  38.58,104.77 90 top
R21  118.74,37.47 180 top
R22  118.74,35.24 180 top
R23  118.74,33.02 180 top
R24  118.74,30.8 180 top
R25  118.74,28.58 180 top
R26  118.74,26.35 180 top
R27  118.74,24.13 180 top
R28  118.74,21.91 180 top
R29  48.1,62.71 90 top
R30  184.47,84.45 90 top
R31  148.11,11.59 90 top
RN1  24.29,82.07 180 top
S1  23.02,73.82 0 top
SG1  173.67,128.91 180 top
SW1  46.2,90.33 90 top
SW2  124.78,72.23 270 top
SW3  38.58,54.77 90 top
SW4  28.42,54.77 90 top
SW5  18.26,54.77 90 top
SW6  8.1,54.77 90 top
SW7  38.58,67.47 90 top
SW8  28.42,67.47 90 top
SW9  18.26,67.47 90 top
SW10  8.1,67.47 90 top
TP1  187.64,128.59 0 top
TP2  8.26,17.94 0 top
TP3  6.98,123.19 0 top
TP4  129.54,6.98 0 top
U1  92.71,76.2 270 top
U2  121.92,115.41 0 top
U3  77.31,118.11 0 top
U4  55.56,124.46 0 top
Y1  69.53,68.58 90 top

### Tracks (layer width: path | path; a pad name or v marks a point on that pad's centre or on a via)
7SEG  (via drill 0.5)
  Top 0.406: Q5.E 103.99,42.69 v103.98,42.7 | v90.96,42.7 92.38,42.7 Q4.E | v64.77,42.7 66.35,42.7 Q2.E v64.78,42.69 v64.77,42.7 | v77.95,42.7 79.37,42.7 Q3.E v77.96,42.69 v77.95,42.7
  Bottom 0.406: v64.77,42.7 v77.95,42.7 v90.96,42.7 v103.98,42.7 JP9.1
+3V3  (via drill 0.5)
  Top 0.61: v52.07,105.09 52.07,59.53 48.42,55.88 v48.42,24.13
  Bottom 0.406: C11.+ U3.2 | C11.+
  Bottom 0.61: C11.+ 77.31,105.89 76.52,105.09 v52.07,105.09 | v48.42,24.13 CN3.2
+5V  (via drill 0.5, 1)
  Top 0.305: C5.2 114.94,118.27 115.25,118.59 117.37,118.59 U2.16 117.47,120.17 117.11,120.54 C6.1
  Top 0.406: CN1.2 CN1.1 146.69,134.94 | JP12.1 R29.2 50.01,63.66 50.16,63.82 | 169.86,134.94 SG1.+ | C6.1 114.46,121.76 113.82,122.4 113.82,134.94 | R4.1 124.24,122.98 124.46,123.19 129.22,123.19 129.7,123.67 129.7,134.94 | v57.63,103.51 P1.E | v119.54,81.28 R3.2 | 68.58,51.75 R1.2 | 68.58,51.75 | v69.53,51.75 68.58,51.75
  Top 0.813: JP7.2 LED2.A v92.39,103.51 92.39,85.88 94.46,83.82 94.46,80.01 | U1.32 96.52,80.01 | 234,114.3 CN9.9 | 234,12.7 234,2.54 233.04,1.59 193.68,1.59 | 234,38.1 234,12.7 | 234,63.5 234,38.1 | 234,88.9 234,63.5 | 234,114.3 234,88.9 | 234,12.7 CN13.9 | 234,38.1 CN12.9 | 234,63.5 CN11.9 | 234,88.9 CN10.9 | DS3.2 193.81,4.26 193.68,4.13 193.68,1.59 | 193.68,1.59 145.41,1.59 144.78,2.22 144.78,12.38 145.41,13.02 148.08,13.02 R31.2 | 199.07,134.94 213.04,134.94 | 213.04,134.94 P3.A | 213.04,134.94 233.36,134.94 234,134.3 234,114.3 | C1.1 96.36,79.85 96.52,80.01 | 199.07,134.94 P2.A | 181.45,134.94 199.07,134.94 | 181.45,134.94 169.86,134.94 146.69,134.94 129.7,134.94 113.82,134.94 104.62,134.94 103.03,136.53 87.63,136.53 86.52,135.41 86.52,120.81 | v86.52,118.11 86.52,120.81 | 179.39,85.88 179.39,113.66 181.45,115.73 181.45,134.94 | 179.39,85.88 DS2.2 | R30.2 184.18,85.85 184.15,85.88 179.39,85.88 | JP9.2 113.19,44.93 112.55,45.56 110.49,45.56 109.7,46.35 109.7,59.85 109.06,60.48 v109.06,81.28 | 50.16,63.66 50.16,60.01 46.99,56.83 v46.99,51.75 v46.99,22.86 | 96.52,80.01 94.46,80.01 | 94.46,80.01 v94.46,74.93 | 50.16,63.66 | v50.16,76.2 50.16,63.82 50.16,63.66 | v84.14,118.11 84.14,120.01 84.77,120.65 86.36,120.65 86.52,120.81
  Bottom 0.406: v92.39,103.51 v57.63,103.51 | v109.06,81.28 v119.54,81.28 | v46.99,51.75 v69.53,51.75 | CN4.2 24.13,24.13 25.4,22.86 v46.99,22.86
  Bottom 0.813: U3.3 79.85,117.32 80.64,118.11 v86.52,118.11 91.76,118.11 92.39,117.48 JP7.2 | JP7.2 | v94.46,74.93 U1.11 83.03,74.93 81.76,76.2 v50.16,76.2 | U1.32 107.79,80.01 v109.06,81.28
+12V
  Top 0.813: U4.1 C13.1 | D3.C 34.45,113.03 | 28.03,113.03 K1.1
  Top 1.27: C12.+ D2.C 42.23,114.3 | U4.1 42.23,114.3 | 34.45,113.03 28.03,113.03 | 42.23,114.3 34.92,114.3 34.45,113.82 34.45,113.03
BCKL
  Top 0.813: DS2.15 R30.1
BEEP
  Top 0.406: JP8.2 165.26,120.17 165.89,119.54 172.66,119.54 R6.1
DYA  (via drill 0.5)
  Top 0.406: v69.85,32.38 DY4.7 | v82.87,32.38 DY1.7 | v108.9,32.38 DY3.7 108.9,39.05 109.54,39.69 117.16,39.69 117.79,39.05 117.79,37.57 R21.2 | v95.88,32.38 DY2.7 v95.88,32.38
  Bottom 0.406: v69.85,32.38 v82.87,32.38 v95.88,32.38 v108.9,32.38
DYB  (via drill 0.5)
  Top 0.406: v85.41,31.12 DY1.6 | v72.39,31.12 DY4.6 | v111.44,31.12 DY3.6 114.3,37.46 116.52,35.24 R22.2 | v98.42,31.12 DY2.6 v98.42,31.12
  Bottom 0.406: v72.39,31.12 v85.41,31.12 v98.42,31.12 v111.44,31.12
DYC  (via drill 0.5)
  Top 0.406: DY3.4 v108.9,27.62 110.17,28.89 v110.17,32.38 | v69.85,27.62 DY4.4 | v82.87,27.62 DY1.4 | R23.2 v116.2,33.02 | v95.88,27.62 DY2.4 v95.88,27.62
  Bottom 0.406: v108.9,27.62 101.92,27.62 101.76,27.46 100.81,27.46 100.65,27.62 v95.88,27.62 v82.87,27.62 v69.85,27.62 | v110.17,32.38 115.57,32.38 v116.2,33.02
DYD  (via drill 0.5)
  Top 0.406: v103.82,29.84 DY3.2 | v90.8,29.84 DY2.2 | v77.79,29.84 DY1.2 | v64.77,29.84 DY4.2 | R24.2 v116.2,30.8
  Bottom 0.406: v64.77,29.84 v77.79,29.84 v90.8,29.84 v103.82,29.84 115.57,29.84 116.2,30.48 v116.2,30.8
DYE  (via drill 0.5)
  Top 0.406: v62.23,25.08 DY4.1 | DY3.1 v101.28,25.08 v101.28,28.58 | v88.26,25.08 DY2.1 | v75.25,25.08 DY1.1 | R25.2 v116.2,28.58
  Bottom 0.406: v62.23,25.08 v75.25,25.08 v88.26,25.08 v101.28,25.08 | v101.28,28.58 107.95,28.58 108.27,28.89 109.54,28.89 109.85,28.58 v116.2,28.58
DYF  (via drill 0.5)
  Top 0.406: v64.77,33.66 DY4.9 | v103.82,33.66 DY3.9 | v114.3,33.66 114.3,26.67 114.62,26.35 R26.2 | v77.79,33.66 DY1.9 v77.79,33.66 | v90.8,33.66 DY2.9 v90.8,33.66
  Bottom 0.406: v64.77,33.66 v77.79,33.66 v90.8,33.66 v103.82,33.66 v114.3,33.66
DYG  (via drill 0.5)
  Top 0.406: v62.23,34.93 DY4.10 | v101.28,34.93 DY3.10 | v75.25,34.93 DY1.10 | v88.26,34.93 DY2.10 | v112.71,34.93 112.71,24.45 113.03,24.13 R27.2
  Bottom 0.406: v62.23,34.93 v75.25,34.93 v88.26,34.93 v101.28,34.93 v112.71,34.93
DYP  (via drill 0.5)
  Top 0.406: v72.39,26.35 DY4.5 | v85.41,26.35 DY1.5 | v98.42,26.35 DY2.5 | v111.44,26.35 DY3.5 116.2,22.23 116.52,21.91 R28.2
  Bottom 0.406: v72.39,26.35 v85.41,26.35 v98.42,26.35 v111.44,26.35
GND  (via drill 0.5)
  Top 0.305: C6.2 119.11,120.54 118.74,120.17 U2.15
  Top 0.406: C10.2 126.09,84.41 127.32,83.19 SW2.1 | SW2.4 SW2.1 | CN1.9 CN1.10 | SW1.1 v41.75,82.07 | SW1.1 | SW1.4 SW1.1 | C2.1 63.45,68.79 v63.5,68.58 63.45,68.69 C3.1 63.45,58.31 64.61,57.15 C8.2 | R7.1 103.19,108.74 103.5,109.06 v103.5,110.97 103.5,113.35 103.66,113.51 103.66,114.4 LED1.C | v178.44,119.38 177.33,119.38 Q1.2 | v117.95,123.51 118.74,123.51 119.06,123.19 119.06,121.81 C6.2 | C7.2 128.91,117.79 v128.91,117.95 | v54.77,108.9 53.07,108.9 C13.2 | v56.36,108.9 58.05,108.9 C14.2 | Q6.2 v41.27,109.85 v41.27,109.86 | SW2.1 v128.91,80.49
  Top 0.813: v96.36,74.45 C1.2 | v96.36,74.45
  Bottom 0.406: v41.75,82.07 RN1.1 | v41.75,82.07
  other vias: 63.5,69.53 63.5,67.63
  pour Bottom (isolate 0.406): 0.63,137.48 248.92,137.48 248.92,0.95 0.63,0.95
INT0
  Top 0.406: JP4.2 117.95,76.2 118.37,76.62 R3.1 120.75,76.62 121.6,77.47 122.71,77.47 122.87,77.31 | C10.1 124.09,84.25 122.87,83.03 SW2.2 122.87,77.31 | 122.87,77.31 SW2.3
  Bottom 0.406: JP4.6 JP4.4 JP4.2
N$1
  Top 0.813: R31.1 148.11,5.07 DS3.20
N$2
  Top 0.406: R10.2 94.19,42.79 Q4.B
N$3
  Top 0.406: Q5.C DY3.8 DY3.3
N$4
  Top 1.27: K1.P CN8.2
N$5
  Top 1.27: K1.O 8.67,101.03 7.78,101.92 CN8.3
N$6
  Top 1.27: K1.S 8.67,112.97 7.78,112.08 CN8.1
N$7
  Top 0.406: JP3.1 C8.1
N$8
  Top 0.406: Q4.C DY2.8 DY2.3
N$9
  Top 0.406: Q2.C DY4.8 DY4.3
N$10
  Top 1.27: CN7.PWR 20.91,121.92 26.35,121.92 26.99,122.55 26.99,127 27.62,127.63 35.88,127.63 36.51,128.27 CN6.1 D2.A
N$11
  Top 0.406: R9.2 81.18,42.79 Q3.B
N$12
  Top 0.406: P1.S 62.71,83.98 63.18,83.5 69.48,83.5 R5.1
N$13
  Top 0.406: R8.2 68.16,42.79 Q2.B
N$15
  Top 0.406: LED2.K R7.2
N$16
  Top 0.813: LED1.A R2.2
N$17
  Top 0.305: C4.1 117.74,110.38 117.47,110.65 U2.1
N$18
  Top 0.305: C4.2 119.74,110.38 120.01,110.65 U2.3
N$19
  Top 0.305: U2.4 121.28,110.97 121.6,110.65 121.92,110.65 122.24,110.33 122.24,109.11 C9.1
N$20
  Top 0.406: R11.2 107.21,42.79 Q5.B
N$21  (via drill 0.5)
  Top 0.406: DS3.18 153.17,13.2 152.88,13.49 v152.88,68.26 | v218.44,68.26 218.44,75.09 218.92,75.57 220.34,75.57 221.46,76.68 221.46,111.76 222.57,112.87 222.57,116.21 221.46,117.32 221.46,129.06 220.98,129.54 P3.E
  Bottom 0.406: v152.88,68.26 v218.44,68.26
N$22  (via drill 0.5)
  Top 0.406: DS3.3 191.27,113.33 v191.29,121.44 | v215.58,121.44 P3.S
  Bottom 0.406: v191.29,121.44 v215.58,121.44
N$23
  Top 0.406: JP6.1 JP6.3 JP6.5 JP6.7 JP6.9 R5.2
N$24  (via drill 0.5)
  Top 0.406: v201.61,82.55 P2.S | DS2.3 v176.85,82.55
  Bottom 0.406: v176.85,82.55 v201.61,82.55
N$25
  Top 0.813: C14.1 U4.3
  Top 1.27: U4.3 62.39,114.3 63.18,113.51 C15.+ 89.22,111.12 89.85,111.76 JP7.1
N$26
  Top 0.406: R19.1 LED10.A
N$27
  Top 0.406: R18.1 LED9.A
N$28
  Top 0.406: R17.1 LED8.A
N$29
  Top 0.406: R16.1 LED7.A
N$30
  Top 0.406: R15.1 LED6.A
N$31
  Top 0.406: R14.1 LED5.A
N$32
  Top 0.406: R13.1 LED4.A
N$33
  Top 0.406: R12.1 LED3.A
N$34
  Top 0.305: U2.5 122.55,111.28 123.19,110.65 124.14,110.65 124.46,110.33 124.46,109.33 C9.2
N$35
  Top 0.305: U2.14 120.01,119.86 120.65,120.49 120.65,123.46 CN5.2
N$36
  Top 0.305: CN5.3 121.92,123.98 121.28,123.35 U2.13
N$37
  Top 0.305: C5.1 118.47,114.41 118.74,114.14 U2.2
N$38
  Top 0.305: U2.6 123.82,114.14 124.14,114.46 128.86,114.46 C7.1
N$39  (via drill 0.5)
  Top 0.406: SW10.3 SW10.2 v10,56.04 SW6.3 SW6.2 v10,43.34 | 40.48,46.2 v40.48,43.34 | 40.48,46.2 SW3.2 | 30.32,46.2 v30.32,43.34 | 30.32,46.2 SW4.2 | v20.16,43.34 SW5.2 SW5.3 v20.16,56.04 SW9.2 SW9.3 | SW7.2 v40.48,56.04 SW3.3 40.48,46.2 | SW8.3 SW8.2 v30.32,56.04 SW4.3 30.32,46.2 | SW7.2 SW7.3 | SW7.2 43.66,59.21 44.29,59.85 JP12.2 46.04,61.12 46.67,61.75 R29.1
  Bottom 0.406: v10,56.04 v20.16,56.04 v30.32,56.04 v40.48,56.04 | v40.48,43.34 v30.32,43.34 v20.16,43.34 v10,43.34
N$40
  Top 0.406: RN1.2 S1.9
N$41
  Top 0.406: RN1.3 S1.10
N$42
  Top 0.406: RN1.4 S1.11
N$43
  Top 0.406: RN1.5 S1.12
N$44
  Top 0.406: RN1.6 S1.13
N$45
  Top 0.406: RN1.7 S1.14
N$46
  Top 0.406: RN1.8 S1.15
N$47
  Top 0.406: RN1.9 S1.16
N$48
  Top 0.305: Q1.3 176.21,125.73 177.48,127 SG1.-
N$49
  Top 0.305: Q1.1 175.26,120.65 174.62,121.29 172.82,121.29 R6.2
N$56
  Top 0.406: Q3.C DY1.8 DY1.3
N$64
  Top 0.61: R20.2 38.58,105.73 39.53,106.68 39.53,107.8 Q6.1
N$66
  Top 0.61: Q6.3 37.31,108.9 36.67,108.27 36.67,105.73 36.35,105.41 34.56,105.41 D3.A
  Top 1.27: K1.2 32.92,101.03 34.45,102.55 D3.A
PD_LED
  Top 0.406: JP10.1 LED3.K LED4.K LED5.K LED6.K LED7.K LED8.K LED9.K LED10.K
RA0  (via drill 0.5)
  Top 0.406: SW3.1 SW3.4 34.45,52.55 34.13,52.86 34.13,69.37 | 33.5,70.01 S1.8 | 34.13,69.37 33.5,70.01 | 34.13,69.37 | 33.5,70.01 34.13,69.37 | S1.8 33.5,70.01 | S1.8 31.91,74.45 33.18,75.72 v33.18,96.52 | v144.46,96.52 v144.46,109.22 | v229.87,109.22 v229.87,124.46
  Bottom 0.406: v33.18,96.52 64.77,96.52 67.47,99.22 70.64,99.22 JP6.2 U1.2 86.36,96.52 v144.46,96.52 | v144.46,109.22 v229.87,109.22 | v229.87,124.46 CN9.1
RA1  (via drill 0.5)
  Top 0.406: SW4.1 SW4.4 27.78,52.55 28.1,52.86 28.1,67.79 29.37,69.06 S1.7 29.37,74.45 30.64,75.72 v30.64,93.98 | v145.57,93.98 v145.57,110.33 | v228.76,110.33 v228.76,123.19
  Bottom 0.406: v30.64,93.98 64.93,93.98 67.47,96.52 70.8,96.52 JP6.4 U1.3 86.36,93.98 v145.57,93.98 | v145.57,110.33 v228.76,110.33 | v228.76,123.19 238.12,123.19 CN9.2
RA2  (via drill 0.5)
  Top 0.406: SW5.4 SW5.1 15.72,7.78 16.35,7.14 41.59,7.14 CN3.8 | v227.49,90.17 v227.49,121.92 | v28.1,91.44 28.1,75.72 26.83,74.45 v26.83,72.39 S1.6 | CN3.8 | v17.94,72.39 17.94,53.02 17.46,52.55 SW5.4 | SW5.4
  Bottom 0.406: v227.49,121.92 CN9.3 | v28.1,91.44 64.93,91.44 67.47,93.98 70.8,93.98 JP6.6 U1.4 86.36,91.44 147.32,91.44 148.59,90.17 v227.49,90.17 | v26.83,72.39 v17.94,72.39
RA3  (via drill 0.5)
  Top 0.406: SW6.1 SW6.4 v3.97,52.55 | v23.97,52.55 24.29,52.86 S1.5 24.29,74.45 25.56,75.72 v25.56,88.9 | v226.22,88.9 v226.22,120.65
  Bottom 0.406: v23.97,52.55 v3.97,52.55 | v226.22,88.9 86.36,88.9 U1.5 JP6.8 70.8,91.44 67.47,91.44 64.93,88.9 v25.56,88.9 | v226.22,120.65 238.12,120.65 CN9.4
RA4  (via drill 0.5)
  Top 0.406: SW7.1 SW7.4 v36.04,86.84 | v224.95,86.36 v224.95,119.38 | S1.4 21.75,74.45 23.02,75.72 v23.02,86.84
  Bottom 0.406: v224.95,86.36 86.36,86.36 U1.6 74.29,87.63 73.02,88.9 67.63,88.9 65.56,86.84 v36.04,86.84 v23.02,86.84 | v224.95,119.38 CN9.5
RA5  (via drill 0.5)
  Top 0.406: SW8.1 SW8.4 v25.88,67.79 | v223.68,83.82 v223.68,118.11 | v20.48,85.09 20.48,75.72 19.21,74.45 S1.3
  Bottom 0.406: 72.07,85.09 JP6.10 | 72.07,85.09 U1.7 86.36,83.82 v223.68,83.82 | S1.3 19.21,68.1 19.53,67.79 v25.88,67.79 | v223.68,118.11 238.12,118.11 CN9.6 | 72.07,85.09 v20.48,85.09
RA6  (via drill 0.5)
  Top 0.406: SW9.1 SW9.4 15.72,68.1 16.67,69.06 S1.2 | v78.74,66.04 v78.74,73.66 | v215.42,66.04 v215.42,117.16
  Bottom 0.406: v78.74,73.66 17.3,73.66 16.67,73.02 S1.2 | U1.14 97.47,67.31 98.74,68.58 133.03,68.58 135.57,66.04 v215.42,66.04 | v215.42,117.16 222.88,117.16 223.2,116.84 CN9.7
  Bottom 0.813: U1.14 84.14,67.31 82.87,66.04 v78.74,66.04 JP2.1
RA7  (via drill 0.5)
  Top 0.406: SW10.1 SW10.4 5.56,69.37 6.19,70.01 S1.1 v14.13,74.93 | JP1.2 v76.52,74.93 | v214.15,73.5 v214.15,111.6
  Bottom 0.406: v76.52,74.93 v14.13,74.93 | U1.13 97.63,69.85 98.9,71.12 108.58,71.12 109.38,71.91 117.79,71.91 119.38,73.5 v214.15,73.5 | v214.15,111.6 231.62,111.6 235.59,115.57 238.12,115.57 CN9.8
  Bottom 0.813: U1.13 84.14,69.85 82.87,71.12 JP1.2
RB0  (via drill 0.5)
  Top 0.406: v156.53,99.06 v156.53,82.55 DS2.11 156.37,19.37 156.05,19.05 156.05,17.62 156.53,17.15 156.53,15.24 156.84,14.92 160.34,14.92 160.81,14.45 160.81,5.07 DS3.15 | JP4.5 v111.28,82.55 | v56.2,81.28 56.2,53.02 55.09,51.91 v55.09,12.7
  Bottom 0.406: v156.53,99.06 CN10.1 | v156.53,82.55 v111.28,82.55 U1.33 98.42,82.55 97.16,81.28 v56.2,81.28 | CN4.7 39.05,11.43 40.32,12.7 v55.09,12.7
RB1  (via drill 0.5)
  Top 0.406: v153.99,100.49 v153.99,85.09 DS2.12 153.99,13.81 154.31,13.49 157.8,13.49 158.12,13.18 158.12,5.19 DS3.16 | v113.82,85.09 JP4.3 | v113.82,85.09
  Bottom 0.406: U1.34 v113.82,85.09 v153.99,85.09 | CN10.2 238.12,100.33 237.97,100.49 v153.99,100.49
RB2  (via drill 0.5)
  Top 0.406: v151.45,96.36 v151.45,87.63 DS2.13 v151.45,69.53 | v116.36,87.63 JP4.1 | v116.36,87.63 | v188.44,69.53 188.59,5.19 DS3.4
  Bottom 0.406: U1.35 v116.36,87.63 v151.45,87.63 | v151.45,96.36 151.61,96.52 CN10.3 | v151.45,69.53 v188.44,69.53
RB3  (via drill 0.5)
  Top 0.406: v147,96.68 v147,90.17 147,77.63 147.48,77.15 DS2.14 v148.91,70.64 | v186.21,70.64 186.21,5.07 DS3.5
  Bottom 0.406: v147,90.17 U1.36 | v186.21,70.64 v148.91,70.64 | CN10.4 238.12,97.79 151.45,97.79 150.34,96.68 v147,96.68
RB4  (via drill 0.5)
  Top 0.406: v174.31,93.98 DS2.4 v174.31,71.91 | DS3.6 183.65,71.89 v183.67,71.91
  Bottom 0.406: U1.37 150.02,92.71 151.29,93.98 v174.31,93.98 CN10.5 | v183.67,71.91 v174.31,71.91
RB5  (via drill 0.5)
  Top 0.406: v169.23,95.25 DS2.6 169.23,75.25 169.7,74.77 169.54,74.61 v169.54,11.91 | v155.73,11.91 155.73,5.07 DS3.17
  Bottom 0.406: U1.38 v169.23,95.25 238.12,95.25 CN10.6 | v155.73,11.91 v169.54,11.91
RB6  (via drill 0.5)
  Top 0.406: CN1.4 CN1.3 149.22,128.27 150.18,127.32 150.18,105.09 150.18,103.19 v150.18,98.11 v150.18,91.44
  Bottom 0.406: JP11.1 81.6,100.97 83.5,99.06 97,99.06 98.27,97.79 U1.39 149.86,97.79 v150.18,98.11 | v150.18,98.11 | v150.18,91.44 CN10.7
RB7  (via drill 0.5)
  Top 0.406: CN1.6 CN1.5 151.76,124.46 v151.76,122.71 v151.76,100.33 152.72,99.38 v152.72,92.71
  Bottom 0.406: U1.40 144.46,100.33 | 144.46,100.33 144.62,100.33 | 144.46,100.33 v151.76,100.33 | CN10.8 238.12,92.71 v152.72,92.71 | v151.76,122.71 JP8.1 | v151.76,122.71
RC0  (via drill 0.5)
  Top 0.406: v57.31,63.34 57.31,52.7 56.2,51.59 v56.2,10.16 | v219.71,63.82 v219.71,73.66
  Bottom 0.406: CN4.8 21.75,10.16 v56.2,10.16 | v57.31,63.34 81.76,63.34 83.19,64.77 U1.15 86.36,66.04 132.72,66.04 134.94,63.82 v219.71,63.82 | v219.71,73.66 CN11.1
RC1  (via drill 0.5)
  Top 0.406: v229.55,61.6 v229.55,72.39
  Bottom 0.406: CN11.2 238.12,72.39 v229.55,72.39 | v229.55,61.6 134.3,61.6 132.4,63.5 93.98,63.5 92.71,62.23 U1.16
RC2  (via drill 0.5)
  Top 0.406: v228.44,59.37 v228.44,71.12
  Bottom 0.406: v228.44,71.12 CN11.3 | v228.44,59.37 133.67,59.37 132.24,60.8 132.08,60.96 95.25,60.96 93.98,59.69 U1.17
RC3  (via drill 0.5)
  Top 0.406: v227.33,55.88 v227.33,69.85 | v52.07,55.72 50.64,54.29 v50.64,16.51
  Bottom 0.406: CN11.4 238.12,69.85 v227.33,69.85 | CN4.4 22.86,19.05 25.4,16.51 CN3.5 v50.64,16.51 | v227.33,55.88 98.58,55.88 97.31,57.15 U1.18 82.39,57.15 80.01,54.77 | v52.07,55.72 70.96,55.72 71.75,54.93 | 76.52,54.13 79.38,54.13 80.01,54.77 | 76.52,54.13 72.55,54.13 71.75,54.93 | 71.75,54.93 | 80.01,54.77 | 76.52,54.13 JP3.2
RC4  (via drill 0.5)
  Top 0.406: v226.22,57.15 v226.22,68.42 | v51.91,57.15 49.53,54.77 v49.53,19.05 | v106.36,57.15 v106.36,117.32
  Bottom 0.406: v226.22,68.42 226.38,68.58 CN11.5 | CN4.3 22.86,21.59 25.4,19.05 CN3.4 v49.53,19.05 | v226.22,57.15 v106.36,57.15 U1.23 99.06,58.42 83.5,58.42 82.55,59.37 72.23,59.37 71.91,59.06 | v51.91,57.15 70.01,57.15 71.91,59.06 | 71.91,59.06 | v106.36,117.32 97.79,117.32 97.47,117.63 97.47,120.69 CN2.2
RC5  (via drill 0.5)
  Top 0.406: v225.11,58.26 v225.11,67.31 | v107.47,59.69 v107.47,118.59 | v95.88,59.69 v95.88,50.64 | v45.56,50.8 45.56,21.91 45.24,21.59 CN3.3
  Bottom 0.406: CN11.6 238.12,67.31 v225.11,67.31 | v225.11,58.26 133.51,58.26 132.08,59.69 v107.47,59.69 U1.24 v95.88,59.69 | v95.88,50.64 48.1,50.64 47.94,50.48 46.35,50.48 46.04,50.8 v45.56,50.8 | CN2.3 98.74,122.71 99.22,122.24 99.22,119.06 99.69,118.59 v107.47,118.59
RC6  (via drill 0.5)
  Top 0.406: v223.84,60.48 v223.84,66.04 | v129.06,62.23 133.03,66.36 133.03,111.92 JP5.2 | v58.42,60.96 58.42,52.23 57.31,51.12 v57.31,29.69 | v17.46,29.69 v17.46,16.51
  Bottom 0.406: v223.84,66.04 CN11.7 | v223.84,60.48 133.98,60.48 132.24,62.23 v129.06,62.23 U1.25 94.3,62.23 93.03,60.96 v58.42,60.96 | v57.31,29.69 v17.46,29.69 | v17.46,16.51 CN4.5
RC7  (via drill 0.5)
  Top 0.406: v53.34,62.23 53.34,55.24 51.75,53.66 v51.75,15.24 | v129.06,64.77 | v129.06,64.77 130.81,66.52 130.81,112.24 JP5.4
  Bottom 0.406: CN11.8 238.12,64.77 235.59,64.77 233.52,62.71 134.62,62.71 132.56,64.77 v129.06,64.77 U1.26 93.66,64.77 92.39,63.5 83.66,63.5 82.39,62.23 v53.34,62.23 | CN4.6 39.05,13.97 40.32,15.24 v51.75,15.24
RD0  (via drill 0.5)
  Top 0.406: DS3.7 180.97,5.19 v180.97,37.46 v180.97,48.26 v180.97,53.34 | R21.1 v129.86,37.46 v129.86,19.05 | v63.18,19.05 R12.2
  Bottom 0.406: v180.97,48.26 CN12.1 | v129.86,37.46 v180.97,37.46 | v129.86,19.05 v63.18,19.05 | v180.97,53.34 94.61,53.34 93.34,54.61 U1.19
RD1  (via drill 0.5)
  Top 0.406: DS3.8 178.44,5.19 v178.44,35.24 v178.44,46.99 v178.44,50.8 | R22.1 v128.59,35.24 v128.59,17.78 | v70.8,17.78 R13.2
  Bottom 0.406: CN12.2 238.12,46.99 v178.44,46.99 | v128.59,35.24 v178.44,35.24 | v128.59,17.78 v70.8,17.78 | v178.44,50.8 98.74,50.8 | 98.74,50.8 | U1.20 97.47,52.07 98.74,50.8
RD2  (via drill 0.5)
  Top 0.406: DS3.9 175.89,5.19 v175.89,33.02 v175.89,45.72 v175.89,52.07 | R23.1 v127.32,33.02 v127.32,16.51 | v78.42,16.51 R14.2
  Bottom 0.406: v175.89,45.72 CN12.3 | v127.32,33.02 v175.89,33.02 | v127.32,16.51 v78.42,16.51 | v175.89,52.07 U1.21
RD3  (via drill 0.5)
  Top 0.406: DS3.10 173.35,5.19 v173.35,30.8 v173.35,44.45 v173.35,54.61 | R24.1 v126.05,30.8 v126.05,15.24 | v86.04,15.24 R15.2
  Bottom 0.406: CN12.4 238.12,44.45 v173.35,44.45 | v173.35,30.8 v126.05,30.8 | v126.05,15.24 v86.04,15.24 | U1.22 v173.35,54.61
RD4  (via drill 0.5)
  Top 0.406: DS3.11 170.81,5.19 v170.81,28.58 v170.81,43.18 v170.81,64.93 | R25.1 v124.78,28.58 v124.78,13.97 | v93.66,13.97 R16.2
  Bottom 0.406: v170.81,43.18 CN12.5 | v170.81,28.58 v124.78,28.58 | v124.78,13.97 v93.66,13.97 | U1.27 132.87,67.31 135.25,64.93 v170.81,64.93
RD5  (via drill 0.5)
  Top 0.406: DS3.12 168.27,5.19 v168.27,26.35 v168.27,41.91 v168.27,67.15 v168.27,71.76 | R26.1 v123.51,26.35 v123.51,12.7 | v101.28,12.7 R17.2
  Bottom 0.406: CN12.6 238.12,41.91 v168.27,41.91 | v168.27,26.35 v123.51,26.35 | v123.51,12.7 v101.28,12.7 | U1.28 133.19,69.85 135.89,67.15 v168.27,67.15
RD6  (via drill 0.5)
  Top 0.406: DS3.13 165.74,5.19 v165.74,24.13 v165.74,40.64 v165.74,74.61 | R27.1 v122.24,24.13 v122.24,11.43 | v108.9,11.43 R18.2
  Bottom 0.406: v165.74,40.64 CN12.7 | v165.74,24.13 v122.24,24.13 | v122.24,11.43 v108.9,11.43 | v165.74,74.61 165.74,74.45 119.06,74.45 117.47,72.87 109.06,72.87 108.58,72.39 U1.29
RD7  (via drill 0.5)
  Top 0.406: DS3.14 163.19,5.19 v163.19,21.91 v163.19,39.37 v163.19,75.57 | R28.1 v120.97,21.91 120.97,10.16 120.55,9.74 R19.2
  Bottom 0.406: CN12.8 238.12,39.37 v163.19,39.37 | v163.19,21.91 v120.97,21.91 | U1.30 108.11,74.93 109.06,73.98 117.32,73.98 118.74,75.41 163.04,75.41 v163.19,75.57
RE0  (via drill 0.5)
  Top 0.406: v92.71,49.37 v92.71,53.34 v92.71,82.55 | v105.57,49.37 105.57,45.14 R11.1 | v161.61,49.37 v161.61,23.02 | v54.77,53.34 | v54.77,53.34 53.97,52.55 v53.97,13.97
  Bottom 0.406: U1.8 v92.71,82.55 | v92.71,49.37 v105.57,49.37 109.38,49.37 v161.61,49.37 | CN13.1 164.31,22.86 164.15,23.02 v161.61,23.02 | v161.61,49.37 | v53.97,13.97 CN3.6 | v92.71,53.34 83.5,53.34 81.91,51.75 71.6,51.75 70.01,53.34 v54.77,53.34
RE1  (via drill 0.5)
  Top 0.406: R10.1 92.55,45.14 92.55,46.35 91.6,47.31 v91.6,47.94 v91.6,55.88 v91.6,80.01 | v160.5,20.8 160.34,20.95 v160.34,48.26 | v54.29,54.61 52.86,53.18 v52.86,11.43
  Bottom 0.406: U1.9 v91.6,80.01 | CN13.2 238.12,21.59 164.78,21.59 163.99,20.8 v160.5,20.8 | v160.34,48.26 93.5,48.26 93.19,47.94 v91.6,47.94 | v52.86,11.43 CN3.7 | v54.29,54.61 70.33,54.61 72.07,52.86 80.01,52.86 83.03,55.88 v91.6,55.88
RE2  (via drill 0.5)
  Top 0.406: v90.49,77.47 v90.49,49.37 v90.49,46.67 | v79.38,49.37 79.38,45.19 R9.1 | v159.07,19.53 159.07,21.43 159.23,21.59 159.23,46.99 v159.07,47.15
  Bottom 0.406: U1.10 v90.49,77.47 | v90.49,49.37 v79.38,49.37 | CN13.3 165.1,20.32 164.31,19.53 v159.07,19.53 | v159.07,47.15 93.03,47.15 92.55,46.67 v90.49,46.67
RE3  (via drill 0.5)
  Top 0.406: R1.1 65.56,51.75 65.25,51.43 65.25,50.96 65.72,50.48 65.72,49.33 D1.A 65.61,47.74 66.36,46.99 66.36,45.19 R8.1 65.56,45.09 65.25,45.4 v64.93,45.4 | v157.64,18.26 v157.64,46.04
  Bottom 0.406: CN13.4 238.12,19.05 165.42,19.05 164.62,18.26 v157.64,18.26 | v157.64,46.04 93.66,46.04 93.03,45.4 v64.93,45.4
RELE
  Top 0.406: R20.1 JP11.2
RXD  (via drill 0.5)
  Top 0.406: v122.55,115.41 U2.12 | v122.55,115.41
  Bottom 0.406: v122.55,115.41 131.44,115.41 JP5.3
TXD
  Top 0.305: U2.11 123.82,119.86 124.14,120.17 125.73,120.17 126.05,120.49 126.05,121.66 R4.2
  Top 0.406: JP5.1 135.25,121.29 134.78,121.76 R4.2 | R4.2
VPP  (via drill 0.5)
  Top 0.406: v89.38,100.33 v89.38,47.78 | v70.33,47.78 70.33,48.9 70.01,49.21 D1.C | CN1.8 CN1.7 154.31,102.23 155.1,101.44 v155.1,99.06 | SW1.2 SW1.3 48.1,101.76 v48.1,102.08
  Bottom 0.406: v89.38,47.78 v70.33,47.78 | v155.1,99.06 151.29,99.06 150.97,99.38 149.54,99.38 149.22,99.06 98.74,99.06 97.47,100.33 v89.38,100.33 U1.1 85.09,101.6 84.61,102.08 v48.1,102.08
VUSB
  Top 0.813: R2.1 JP7.3 94.93,120.69 CN2.1
Y1OSC3
  Top 0.813: JP1.1 Y1.2 C2.2
Y1OSC4
  Top 0.813: JP2.2 Y1.1 C3.2

### Text on the board
Top: LComp
Bottom: LComp
tPlace: CONTRASTE | BUZZER | USB | GND | ICSP | RA0 | RA1 | RA2 | RA3 | LCD | GLCD | GND | RA4 | RA5 | RA6 | RA7 | LCD 2X16 | VCC | GND | RX | TX | PORTA | RE3 | RB7 | QSPIC | Master | RB0 | RB1 | RA0 | RB6 | RB2 | RB3 | RA1 | RB5 | www.qsptec.com | RB4 | RB5 | RA2 | RB4 | Ver1.0 | RB6 | RB7 | RA3 | RB3 | RA4 | RB2 | VCC | GND | RA5 | RB1 | PORTB | RE0 | RB0 | RE1 | VCC | RESET | RE2 | GND | VCC | RD7 | RC0 | RC1 | GND | RD6 | RB0 | RB1 | RB2 | RC2 | RC3 | RA7 | RA0 | RA7 | RD5 | INT | GLCD 128X64 | RC4 | RC5 | RA6 | RD4 | RC6 | RC7 | RC0 | RC7 | VCC | GND | RC1 | RC6 | RC2 | RC5 | PORTC | RC3 | RC4 | RD0 | RD3 | RD1 | RD2 | RD0 | RD1 | RD2 | RD3 | RD4 | RD5 | RD6 | RD7 | MODULOS | VCC | GND | CLICK | PORTD | GND | GND | PORTE | +5V | +3V3 | SDA | MOSI | RE0 | RE1 | SCL | MISO | RE2 | RE3 | TXD | SCK | GND | RXD | MIKRO | BUS | CS1 | INT0 | RESET | VCC | GND | PWM | AN1 | GND